# EAGLE schematic WMHS Team A Mission Possible Electrical (EAGLE 8.5.2)

## Sheet 1 of 16: Starting Action
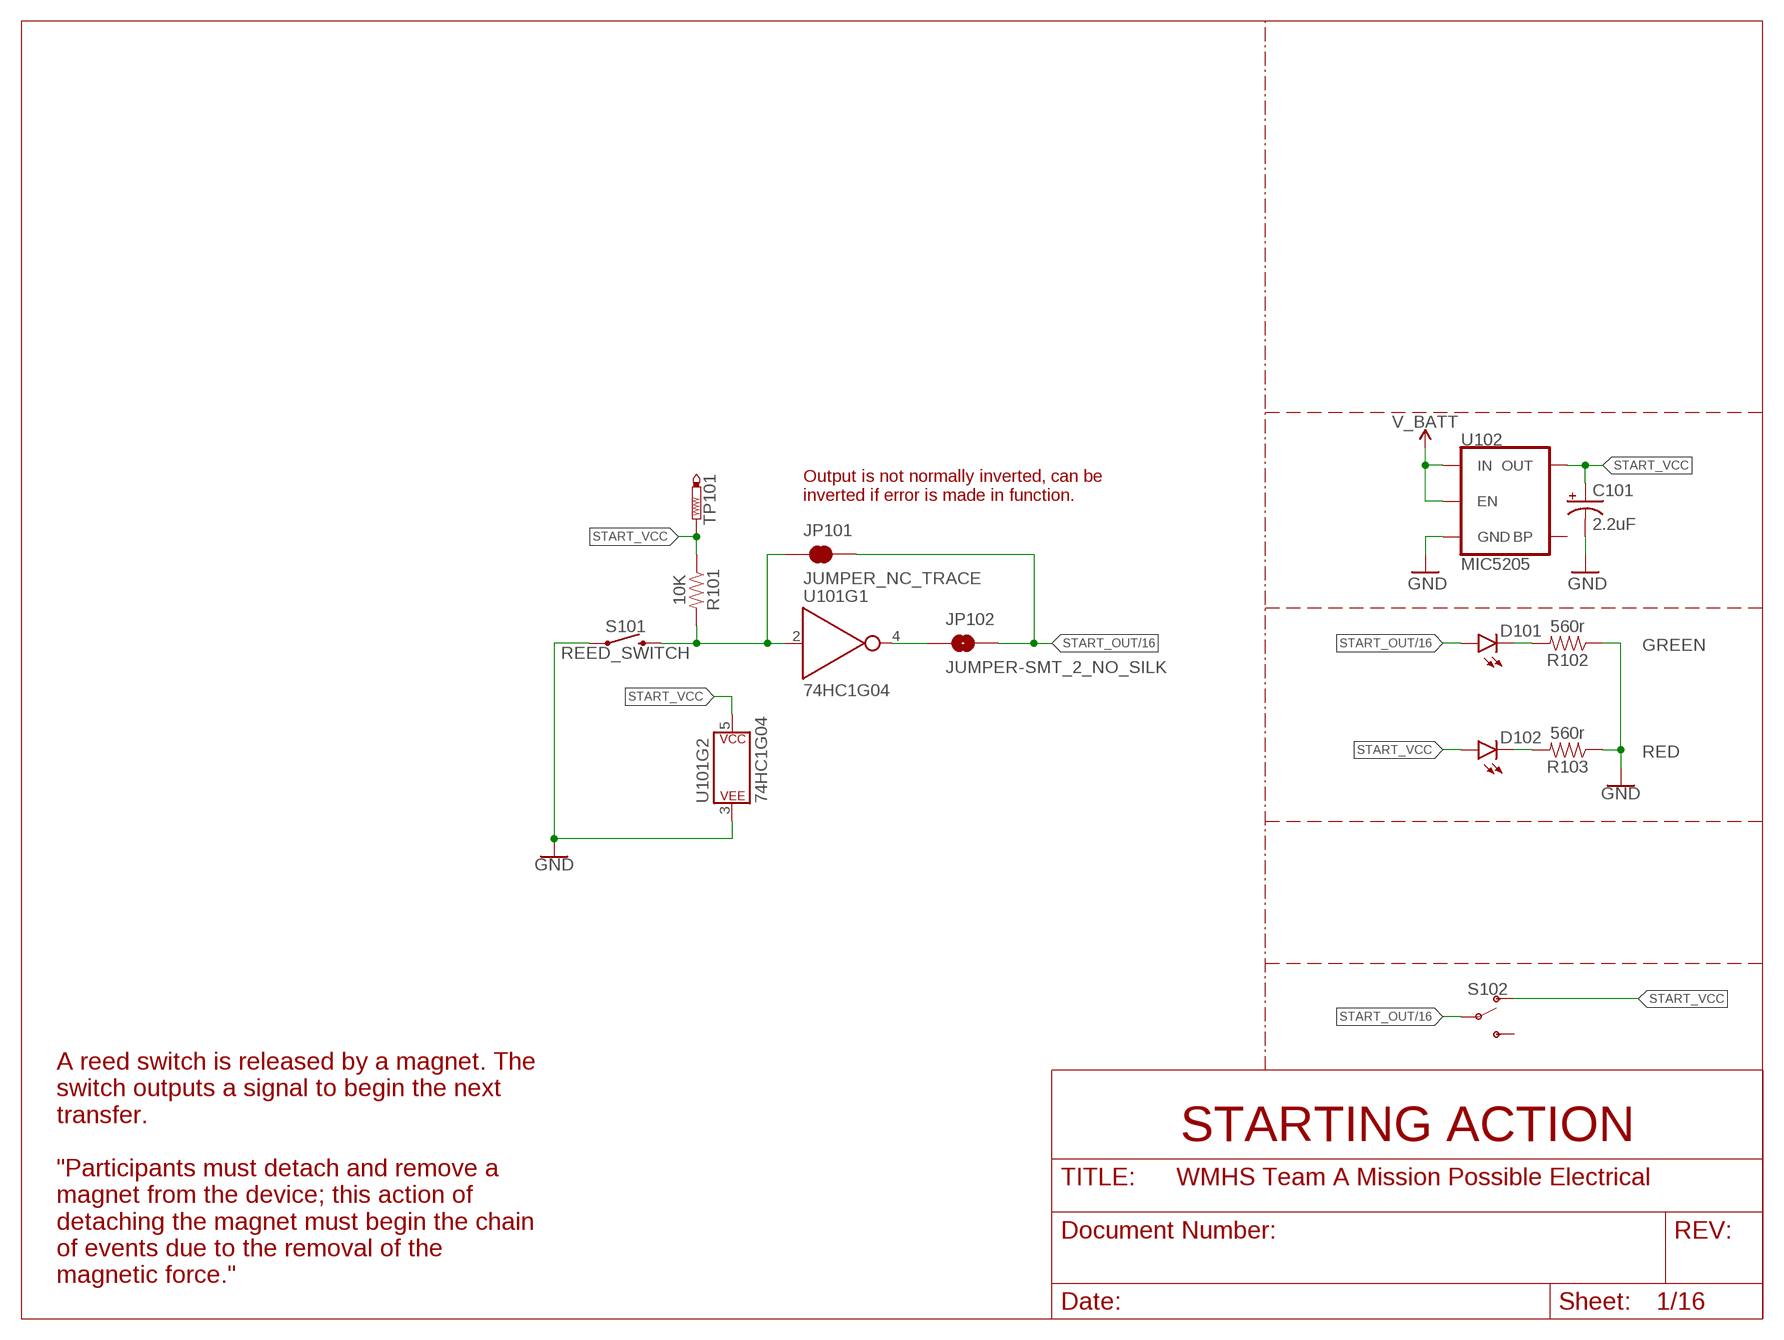
[diagram p0: schematic, sheet 1]

### Parts
C101  2.2uF  10UF-POLAR-EIA3216-16V-10%(TANT)  [EIA3216]
D101  GREEN  LED-GREEN0603  [LED-0603]
D102  RED  LED-RED0603  [LED-0603]
JP101  JUMPER_NC_TRACE  JUMPER-SMT_2_NC_TRACE_SILK  [SMT-JUMPER_2_NC_TRACE_SILK]
JP102  JUMPER-SMT_2_NO_SILK  [SMT-JUMPER_2_NO_SILK]
R101  10K  330OHM-0603-1/10W-1%  [0603]
R102  560r  330OHM-0603-1/10W-1%  [0603]
R103  560r  330OHM-0603-1/10W-1%  [0603]
S101  REED_SWITCH  MDSM-10_REED_SWITCH  [AXIAL_GULLWING_REED]
S102  SWITCH-SPDT-SMD-AYZ0202  [SWITCH_DPDT_SMD_AYZ0202]
TP101  PTR1TP20R  [TP20R]
U101  74HC1G04  [SOT353]
U102  MIC5205  V_REG_MIC52055V  [SOT23-5]

### Nets
GND: C101.- R102.1 R103.1 S101.P$1 U101.3(P$V-) U102.2(GND) ; also sheet 2,3,4,5,6,7,8,9,10,11,12,13,14,15,16
N$10: JP102.1 U101.4(Y)
N$16: JP101.1 R101.2 S101.P$2 U101.2(A)
N$132: D102.C R103.2
N$133: D101.C R102.2
START_OUT: D101.A JP101.2 JP102.2 S102.2(P) ; also sheet 16
START_VCC: C101.+ D102.A R101.1 S102.1(O) TP101.TP U101.5(P$V+) U102.5(OUT)
V_BATT: U102.1(IN) U102.3(EN) ; also sheet 2,3,4,5,6,7,8,9,10,11,12,13,14,15,16
Unconnected: S102.3(S) U102.4(BP)

### Notes on the sheet
- Output is not normally inverted, can be 
  inverted if error is made in function.
- A reed switch is released by a magnet. The 
  switch outputs a signal to begin the next 
  transfer.
- STARTING ACTION
- "Participants must detach and remove a
  magnet from the device; this action of 
  detaching the magnet must begin the chain 
  of events due to the removal of the 
  magnetic force."

## Sheet 2 of 16: Coin Flip
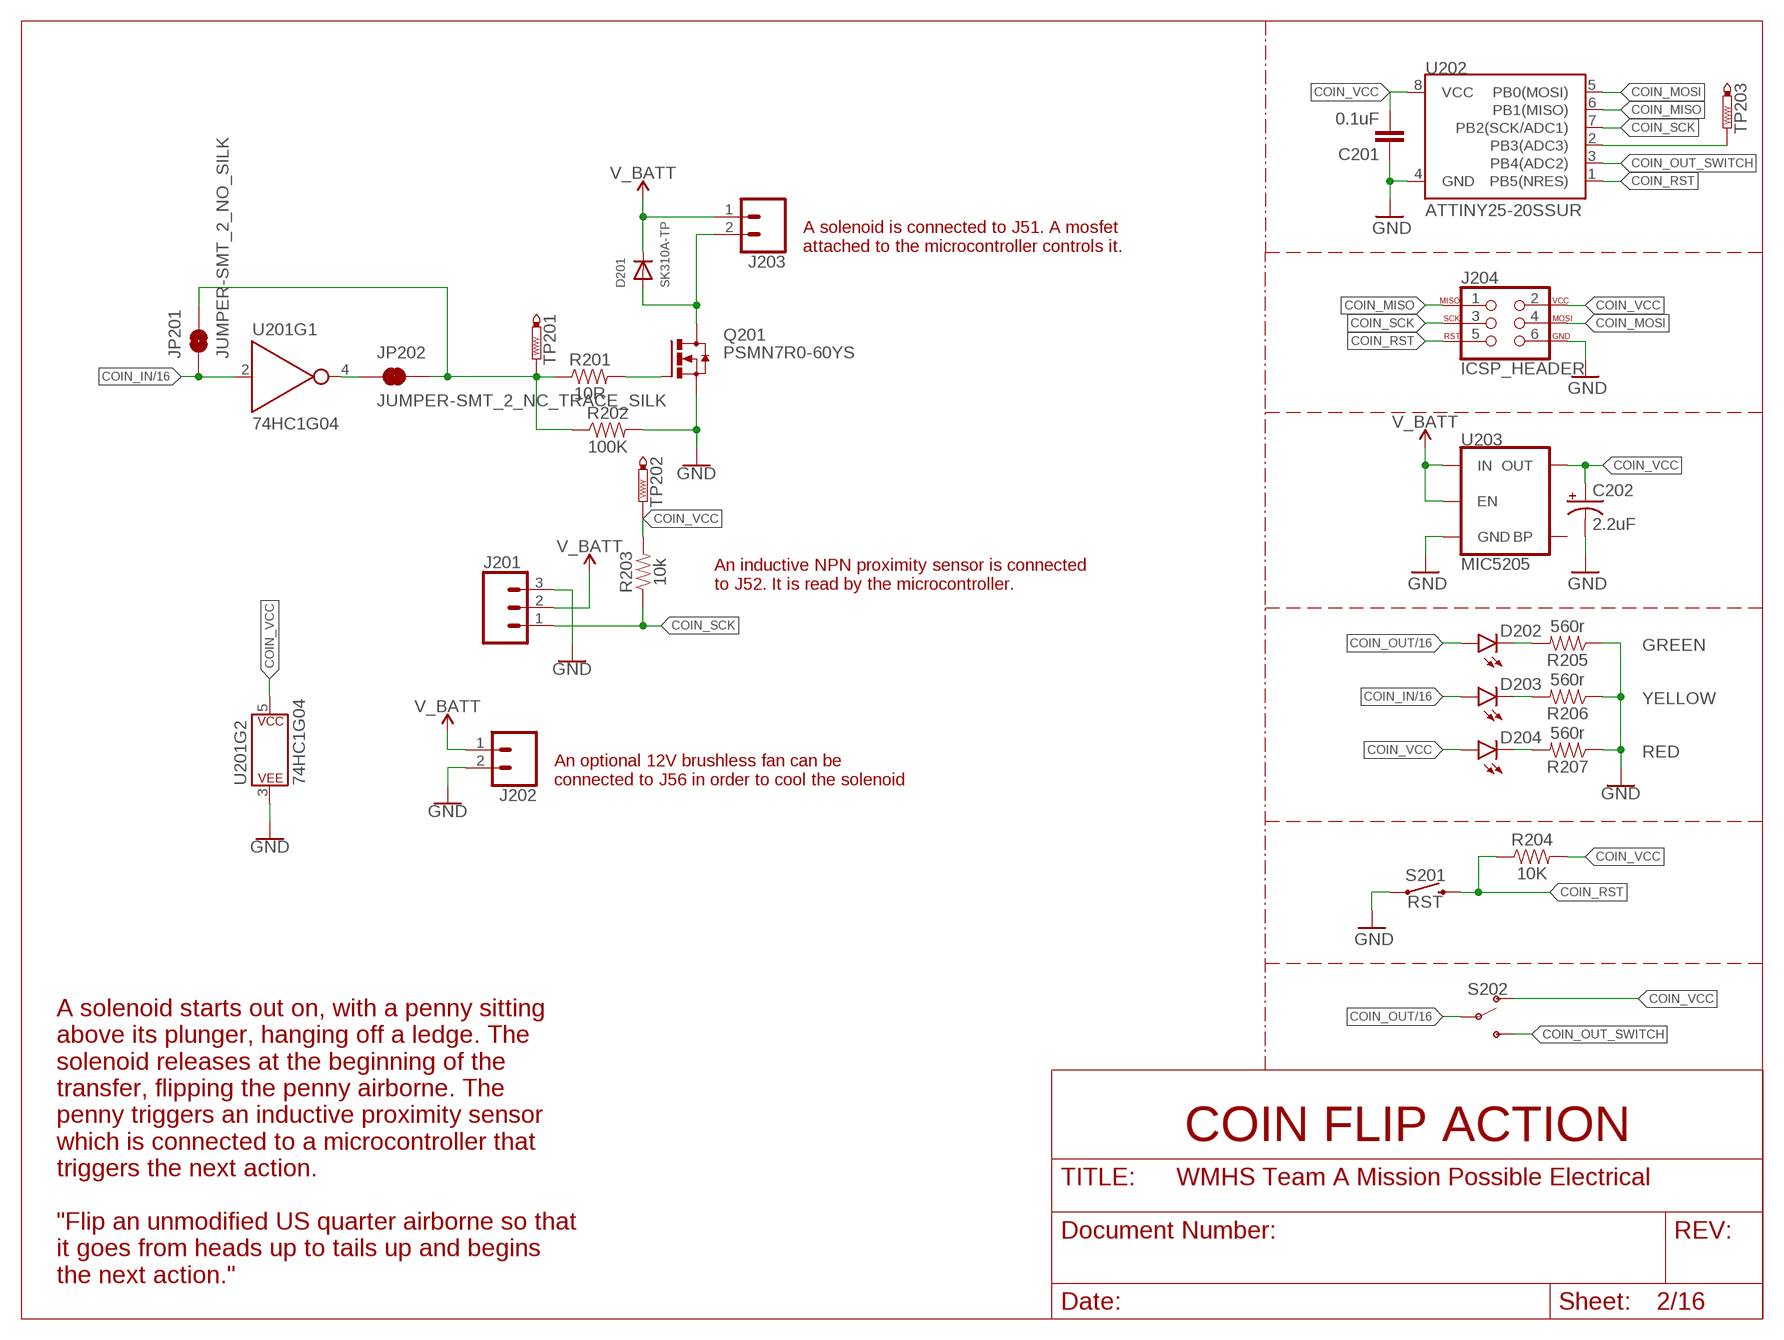
[diagram p1: schematic, sheet 2]

### Parts
C201  0.1uF  0.1UF-0603-25V-5%  [0603]
C202  2.2uF  10UF-POLAR-EIA3216-16V-10%(TANT)  [EIA3216]
D201  SK310A-TP  DIODESMA  [SMADIODE]
D202  GREEN  LED-GREEN0603  [LED-0603]
D203  YELLOW  LED-YELLOW0603  [LED-0603]
D204  RED  LED-RED0603  [LED-0603]
J201  CONN_03LOCK  [1X03_LOCK]
J202  CONN_02LOCK  [1X02_LOCK]
J203  CONN_023.5MM_LOCK  [SCREWTERMINAL-3.5MM-2_LOCK]
J204  ICSP_HEADER  AVR_SPI_PROG_3X2PTH  [2X3]
JP201  JUMPER-SMT_2_NO_SILK  [SMT-JUMPER_2_NO_SILK]
JP202  JUMPER-SMT_2_NC_TRACE_SILK  [SMT-JUMPER_2_NC_TRACE_SILK]
Q201  PSMN7R0-60YS  [SOT669]
R201  10R  RESISTOR0603  [0603]
R202  100K  RESISTOR0603  [0603]
R203  10k  RESISTOR0603  [0603]
R204  10K  330OHM-0603-1/10W-1%  [0603]
R205  560r  330OHM-0603-1/10W-1%  [0603]
R206  560r  330OHM-0603-1/10W-1%  [0603]
R207  560r  330OHM-0603-1/10W-1%  [0603]
S201  RST  MOMENTARY-SWITCH-SPST-SMD-5.2-REDUNDANT  [TACTILE_SWITCH_SMD_5.2MM]
S202  SWITCH-SPDT-SMD-AYZ0202  [SWITCH_DPDT_SMD_AYZ0202]
TP201  PTR1TP20R  [TP20R]
TP202  PTR1TP20R  [TP20R]
TP203  PTR1TP20R  [TP20R]
U201  74HC1G04  [SOT353]
U202  ATTINY25-20SSUR  ATTINY45-SMT-NARROW  [SOIC8]
U203  MIC5205  V_REG_MIC52055V  [SOT23-5]

### Nets
COIN_IN: D203.A JP201.1 U201.2(A) ; also sheet 16
COIN_MISO: J204.1 U202.6(PB1(MISO))
COIN_MOSI: J204.4 U202.5(PB0(MOSI))
COIN_OUT: D202.A S202.2(P) ; also sheet 16
COIN_OUT_SWITCH: S202.3(S) U202.3(PB4(ADC2))
COIN_RST: J204.5 R204.1 S201.3 S201.4 U202.1(PB5(NRES))
COIN_SCK: J201.1 J204.3 R203.1 U202.7(PB2(SCK/ADC1))
COIN_VCC: C201.2 C202.+ D204.A J204.2 R203.2 R204.2 S202.1(O) TP202.TP U201.5(P$V+) U202.8(VCC) U203.5(OUT)
GND: C201.1 C202.- J201.3 J202.2 J204.6 Q201.1(S) Q201.2(S) Q201.3(S) R202.2 R205.1 R206.1 R207.1 S201.1 S201.2 U201.3(P$V-) U202.4(GND) U203.2(GND) ; also sheet 1,3,4,5,6,7,8,9,10,11,12,13,14,15,16
N$17: TP203.TP U202.2(PB3(ADC3))
N$19: JP201.2 JP202.2 R201.1 R202.1 TP201.TP
N$20: JP202.1 U201.4(Y)
N$101: Q201.4(G) R201.2
N$102: D201.A J203.2 Q201.MB(D)
N$134: D204.C R207.2
N$135: D203.C R206.2
N$136: D202.C R205.2
V_BATT: D201.C J201.2 J202.1 J203.1 U203.1(IN) U203.3(EN) ; also sheet 1,3,4,5,6,7,8,9,10,11,12,13,14,15,16
Unconnected: U203.4(BP)

### Notes on the sheet
- A solenoid is connected to J51. A mosfet 
  attached to the microcontroller controls it.
- An inductive NPN proximity sensor is connected 
  to J52. It is read by the microcontroller.
- An optional 12V brushless fan can be 
  connected to J56 in order to cool the solenoid
- COIN FLIP ACTION
- A solenoid starts out on, with a penny sitting 
  above its plunger, hanging off a ledge. The 
  solenoid releases at the beginning of the 
  transfer, flipping the penny airborne. The 
  penny triggers an inductive proximity sensor 
  which is connected to a microcontroller that 
  triggers the next action.
- "Flip an unmodified US quarter airborne so that 
  it goes from heads up to tails up and begins 
  the next action."

## Sheet 3 of 16: Exothermic
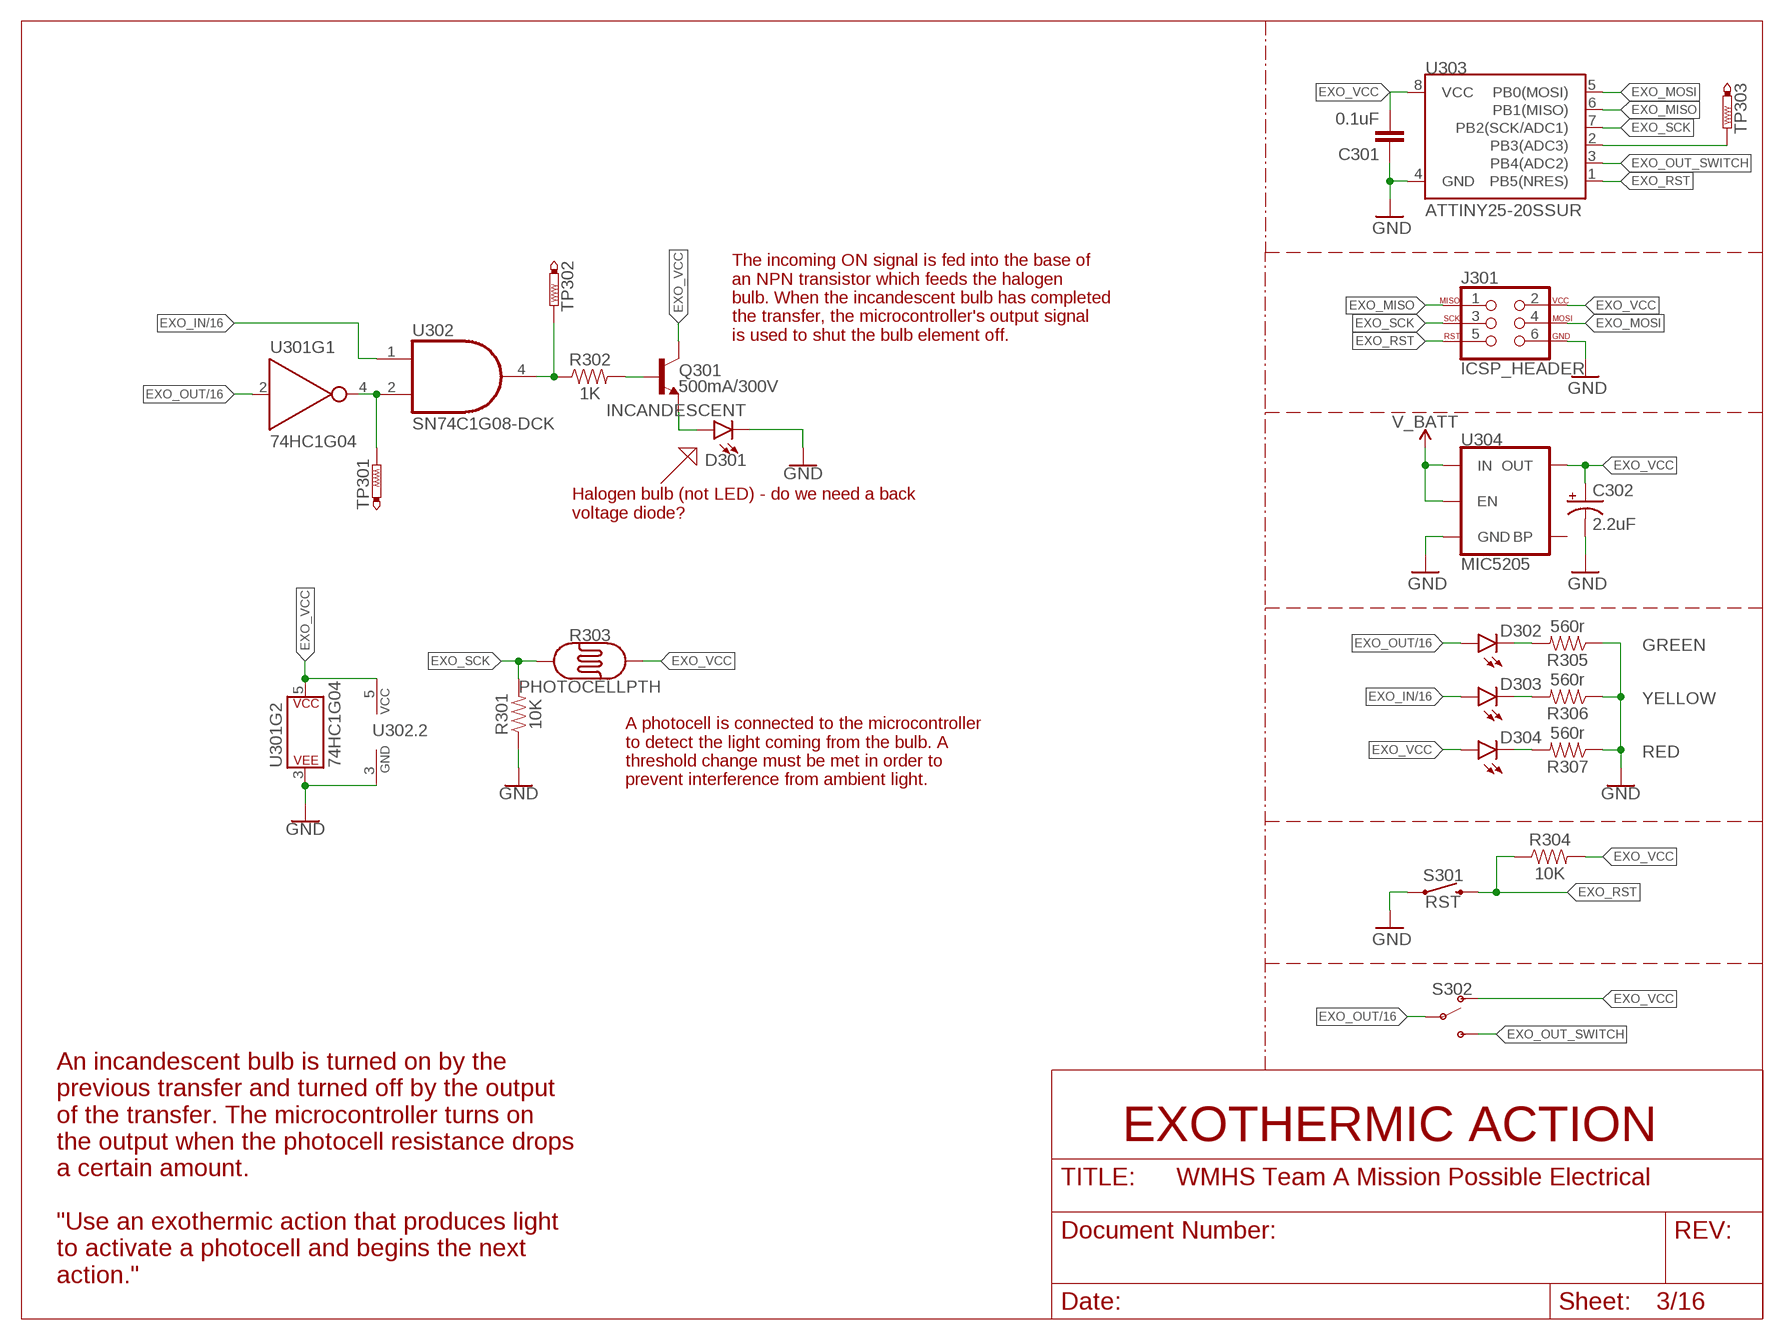
[diagram p2: schematic, sheet 3]

### Parts
C301  0.1uF  0.1UF-0603-25V-5%  [0603]
C302  2.2uF  10UF-POLAR-EIA3216-16V-10%(TANT)  [EIA3216]
D301  INCANDESCENT  LED3MM  [LED_3MM]
D302  GREEN  LED-GREEN0603  [LED-0603]
D303  YELLOW  LED-YELLOW0603  [LED-0603]
D304  RED  LED-RED0603  [LED-0603]
J301  ICSP_HEADER  AVR_SPI_PROG_3X2PTH  [2X3]
Q301  500mA/300V  TRANS_NPN-MMBTA42  [SOT23-3]
R301  10K  RESISTOR0603  [0603]
R302  1K  RESISTOR0603  [0603]
R303  PHOTOCELLPTH  [PHOTOCELL]
R304  10K  330OHM-0603-1/10W-1%  [0603]
R305  560r  330OHM-0603-1/10W-1%  [0603]
R306  560r  330OHM-0603-1/10W-1%  [0603]
R307  560r  330OHM-0603-1/10W-1%  [0603]
S301  RST  MOMENTARY-SWITCH-SPST-SMD-5.2-REDUNDANT  [TACTILE_SWITCH_SMD_5.2MM]
S302  SWITCH-SPDT-SMD-AYZ0202  [SWITCH_DPDT_SMD_AYZ0202]
TP301  PTR1TP20R  [TP20R]
TP302  PTR1TP20R  [TP20R]
TP303  PTR1TP20R  [TP20R]
U301  74HC1G04  [SOT353]
U302  SN74C1G08-DCK  [SC-70-5]
U303  ATTINY25-20SSUR  ATTINY45-SMT-NARROW  [SOIC8]
U304  MIC5205  V_REG_MIC52055V  [SOT23-5]

### Nets
EXO_IN: D303.A U302.1(A) ; also sheet 16
EXO_MISO: J301.1 U303.6(PB1(MISO))
EXO_MOSI: J301.4 U303.5(PB0(MOSI))
EXO_OUT: D302.A S302.2(P) U301.2(A) ; also sheet 16
EXO_OUT_SWITCH: S302.3(S) U303.3(PB4(ADC2))
EXO_RST: J301.5 R304.1 S301.3 S301.4 U303.1(PB5(NRES))
EXO_SCK: J301.3 R301.2 R303.1 U303.7(PB2(SCK/ADC1))
EXO_VCC: C301.2 C302.+ D304.A J301.2 Q301.3(C) R303.2 R304.2 S302.1(O) U301.5(P$V+) U302.5(VCC) U303.8(VCC) U304.5(OUT)
GND: C301.1 C302.- D301.K(C) J301.6 R301.1 R305.1 R306.1 R307.1 S301.1 S301.2 U301.3(P$V-) U302.3(GND) U303.4(GND) U304.2(GND) ; also sheet 1,2,4,5,6,7,8,9,10,11,12,13,14,15,16
N$3: R302.1 TP302.TP U302.4(Y)
N$4: TP301.TP U301.4(Y) U302.2(B)
N$22: TP303.TP U303.2(PB3(ADC3))
N$97: Q301.1(B) R302.2
N$98: D301.A Q301.2(E)
N$137: D304.C R307.2
N$138: D303.C R306.2
N$139: D302.C R305.2
V_BATT: U304.1(IN) U304.3(EN) ; also sheet 1,2,4,5,6,7,8,9,10,11,12,13,14,15,16
Unconnected: U304.4(BP)

### Notes on the sheet
- The incoming ON signal is fed into the base of 
  an NPN transistor which feeds the halogen 
  bulb. When the incandescent bulb has completed 
  the transfer, the microcontroller's output signal 
  is used to shut the bulb element off.
- Halogen bulb (not LED) - do we need a back 
  voltage diode?
- A photocell is connected to the microcontroller 
  to detect the light coming from the bulb. A 
  threshold change must be met in order to 
  prevent interference from ambient light.
- EXOTHERMIC ACTION
- An incandescent bulb is turned on by the 
  previous transfer and turned off by the output 
  of the transfer. The microcontroller turns on 
  the output when the photocell resistance drops 
  a certain amount.
- "Use an exothermic action that produces light 
  to activate a photocell and begins the next 
  action."

## Sheet 4 of 16: Light Triggered
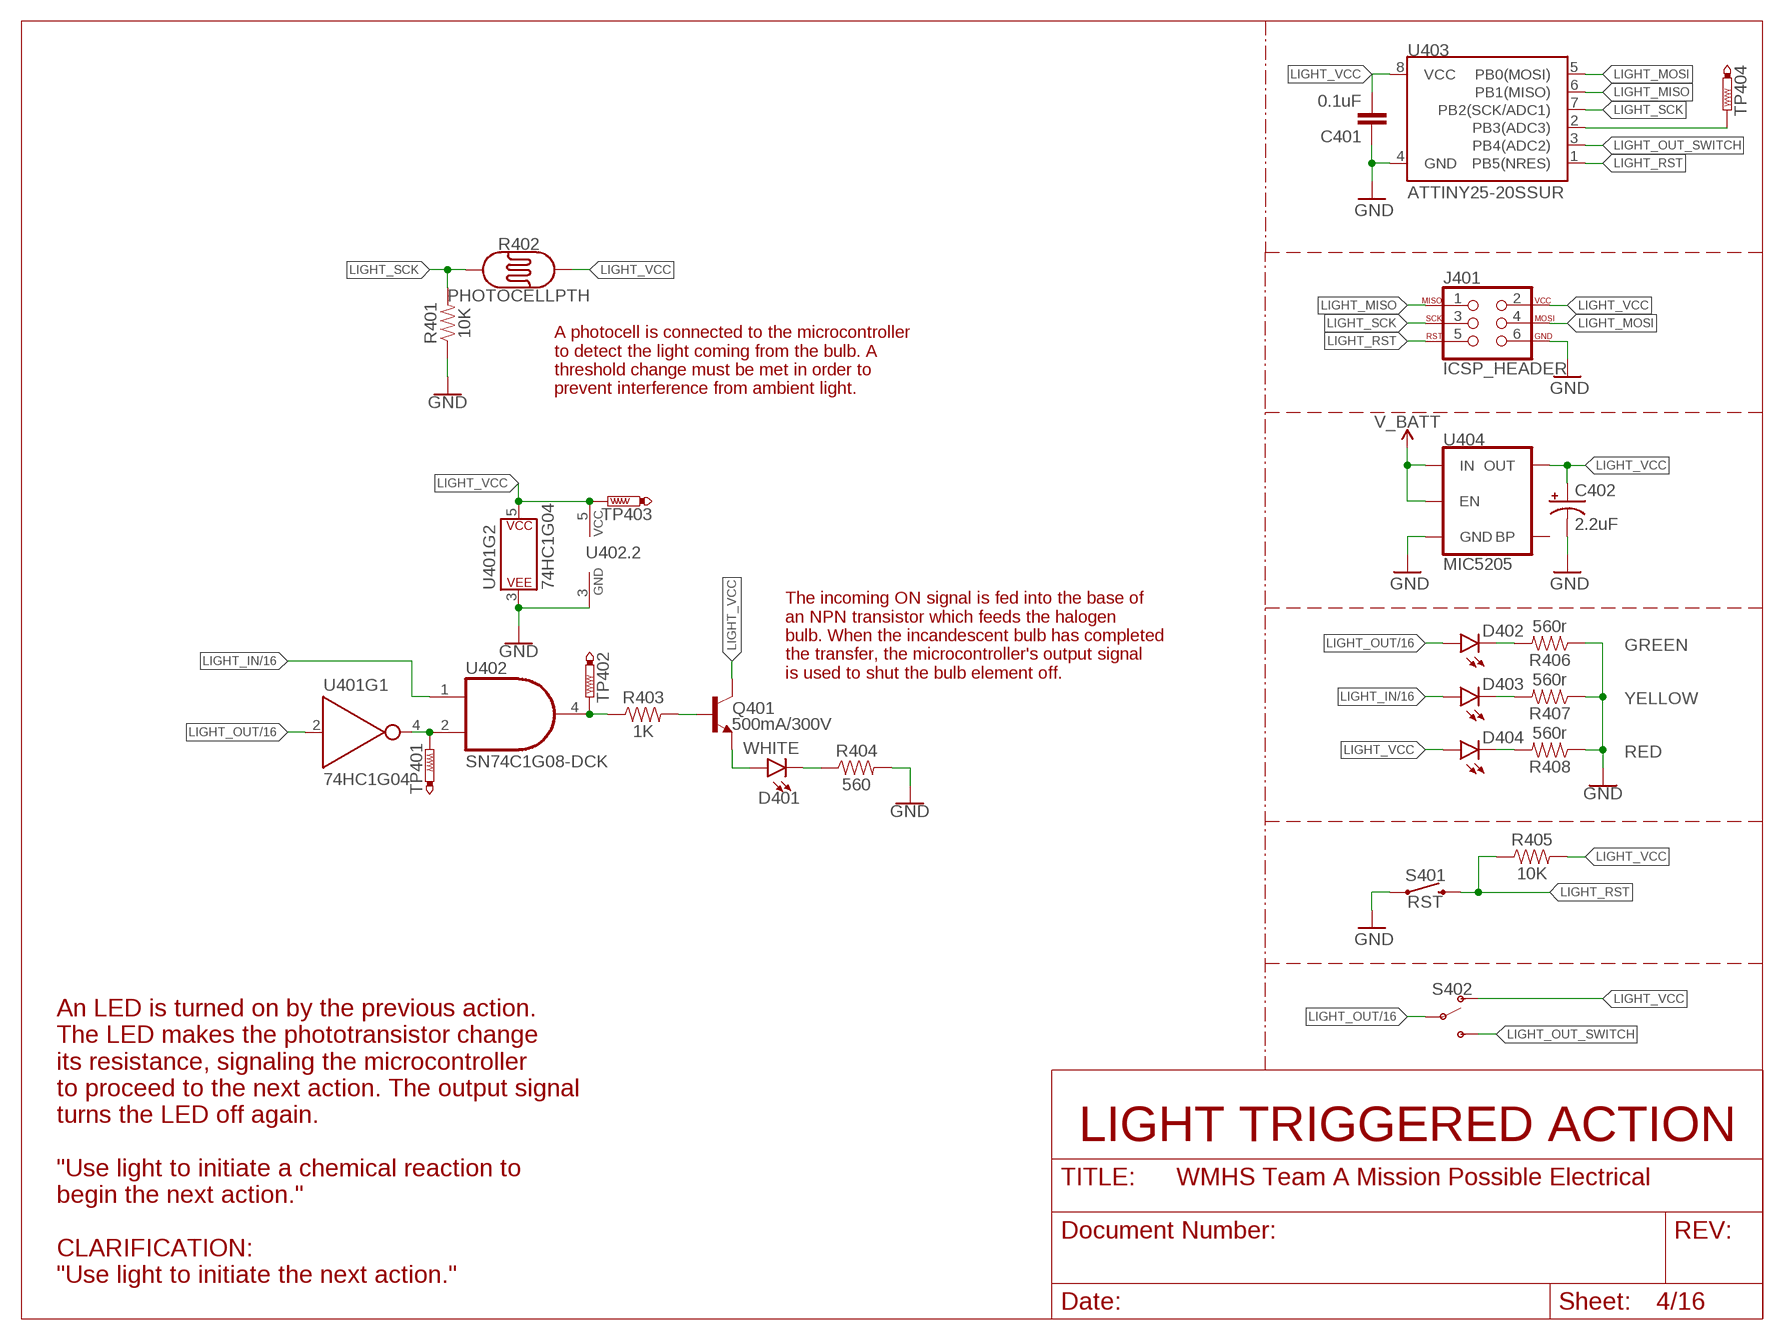
[diagram p3: schematic, sheet 4]

### Parts
C401  0.1uF  0.1UF-0603-25V-5%  [0603]
C402  2.2uF  10UF-POLAR-EIA3216-16V-10%(TANT)  [EIA3216]
D401  WHITE  LED3MM  [LED_3MM]
D402  GREEN  LED-GREEN0603  [LED-0603]
D403  YELLOW  LED-YELLOW0603  [LED-0603]
D404  RED  LED-RED0603  [LED-0603]
J401  ICSP_HEADER  AVR_SPI_PROG_3X2PTH  [2X3]
Q401  500mA/300V  TRANS_NPN-MMBTA42  [SOT23-3]
R401  10K  RESISTOR0603  [0603]
R402  PHOTOCELLPTH  [PHOTOCELL]
R403  1K  RESISTOR0603  [0603]
R404  560  RESISTOR0603  [0603]
R405  10K  330OHM-0603-1/10W-1%  [0603]
R406  560r  330OHM-0603-1/10W-1%  [0603]
R407  560r  330OHM-0603-1/10W-1%  [0603]
R408  560r  330OHM-0603-1/10W-1%  [0603]
S401  RST  MOMENTARY-SWITCH-SPST-SMD-5.2-REDUNDANT  [TACTILE_SWITCH_SMD_5.2MM]
S402  SWITCH-SPDT-SMD-AYZ0202  [SWITCH_DPDT_SMD_AYZ0202]
TP401  PTR1TP20R  [TP20R]
TP402  PTR1TP20R  [TP20R]
TP403  PTR1TP20R  [TP20R]
TP404  PTR1TP20R  [TP20R]
U401  74HC1G04  [SOT353]
U402  SN74C1G08-DCK  [SC-70-5]
U403  ATTINY25-20SSUR  ATTINY45-SMT-NARROW  [SOIC8]
U404  MIC5205  V_REG_MIC52055V  [SOT23-5]

### Nets
GND: C401.1 C402.- J401.6 R401.1 R404.2 R406.1 R407.1 R408.1 S401.1 S401.2 U401.3(P$V-) U402.3(GND) U403.4(GND) U404.2(GND) ; also sheet 1,2,3,5,6,7,8,9,10,11,12,13,14,15,16
LIGHT_IN: D403.A U402.1(A) ; also sheet 16
LIGHT_MISO: J401.1 U403.6(PB1(MISO))
LIGHT_MOSI: J401.4 U403.5(PB0(MOSI))
LIGHT_OUT: D402.A S402.2(P) U401.2(A) ; also sheet 16
LIGHT_OUT_SWITCH: S402.3(S) U403.3(PB4(ADC2))
LIGHT_RST: J401.5 R405.1 S401.3 S401.4 U403.1(PB5(NRES))
LIGHT_SCK: J401.3 R401.2 R402.1 U403.7(PB2(SCK/ADC1))
LIGHT_VCC: C401.2 C402.+ D404.A J401.2 Q401.3(C) R402.2 R405.2 S402.1(O) TP403.TP U401.5(P$V+) U402.5(VCC) U403.8(VCC) U404.5(OUT)
N$6: Q401.1(B) R403.2
N$7: D401.A Q401.2(E)
N$8: R403.1 TP402.TP U402.4(Y)
N$9: TP401.TP U401.4(Y) U402.2(B)
N$23: TP404.TP U403.2(PB3(ADC3))
N$48: D401.K(C) R404.1
N$140: D404.C R408.2
N$141: D403.C R407.2
N$142: D402.C R406.2
V_BATT: U404.1(IN) U404.3(EN) ; also sheet 1,2,3,5,6,7,8,9,10,11,12,13,14,15,16
Unconnected: U404.4(BP)

### Notes on the sheet
- A photocell is connected to the microcontroller 
  to detect the light coming from the bulb. A 
  threshold change must be met in order to 
  prevent interference from ambient light.
- The incoming ON signal is fed into the base of 
  an NPN transistor which feeds the halogen 
  bulb. When the incandescent bulb has completed 
  the transfer, the microcontroller's output signal 
  is used to shut the bulb element off.
- An LED is turned on by the previous action. 
  The LED makes the phototransistor change 
  its resistance, signaling the microcontroller 
  to proceed to the next action. The output signal 
  turns the LED off again.
- LIGHT TRIGGERED ACTION
- "Use light to initiate a chemical reaction to 
  begin the next action."
  
  CLARIFICATION:
  "Use light to initiate the next action."

## Sheet 5 of 16: Endothermic
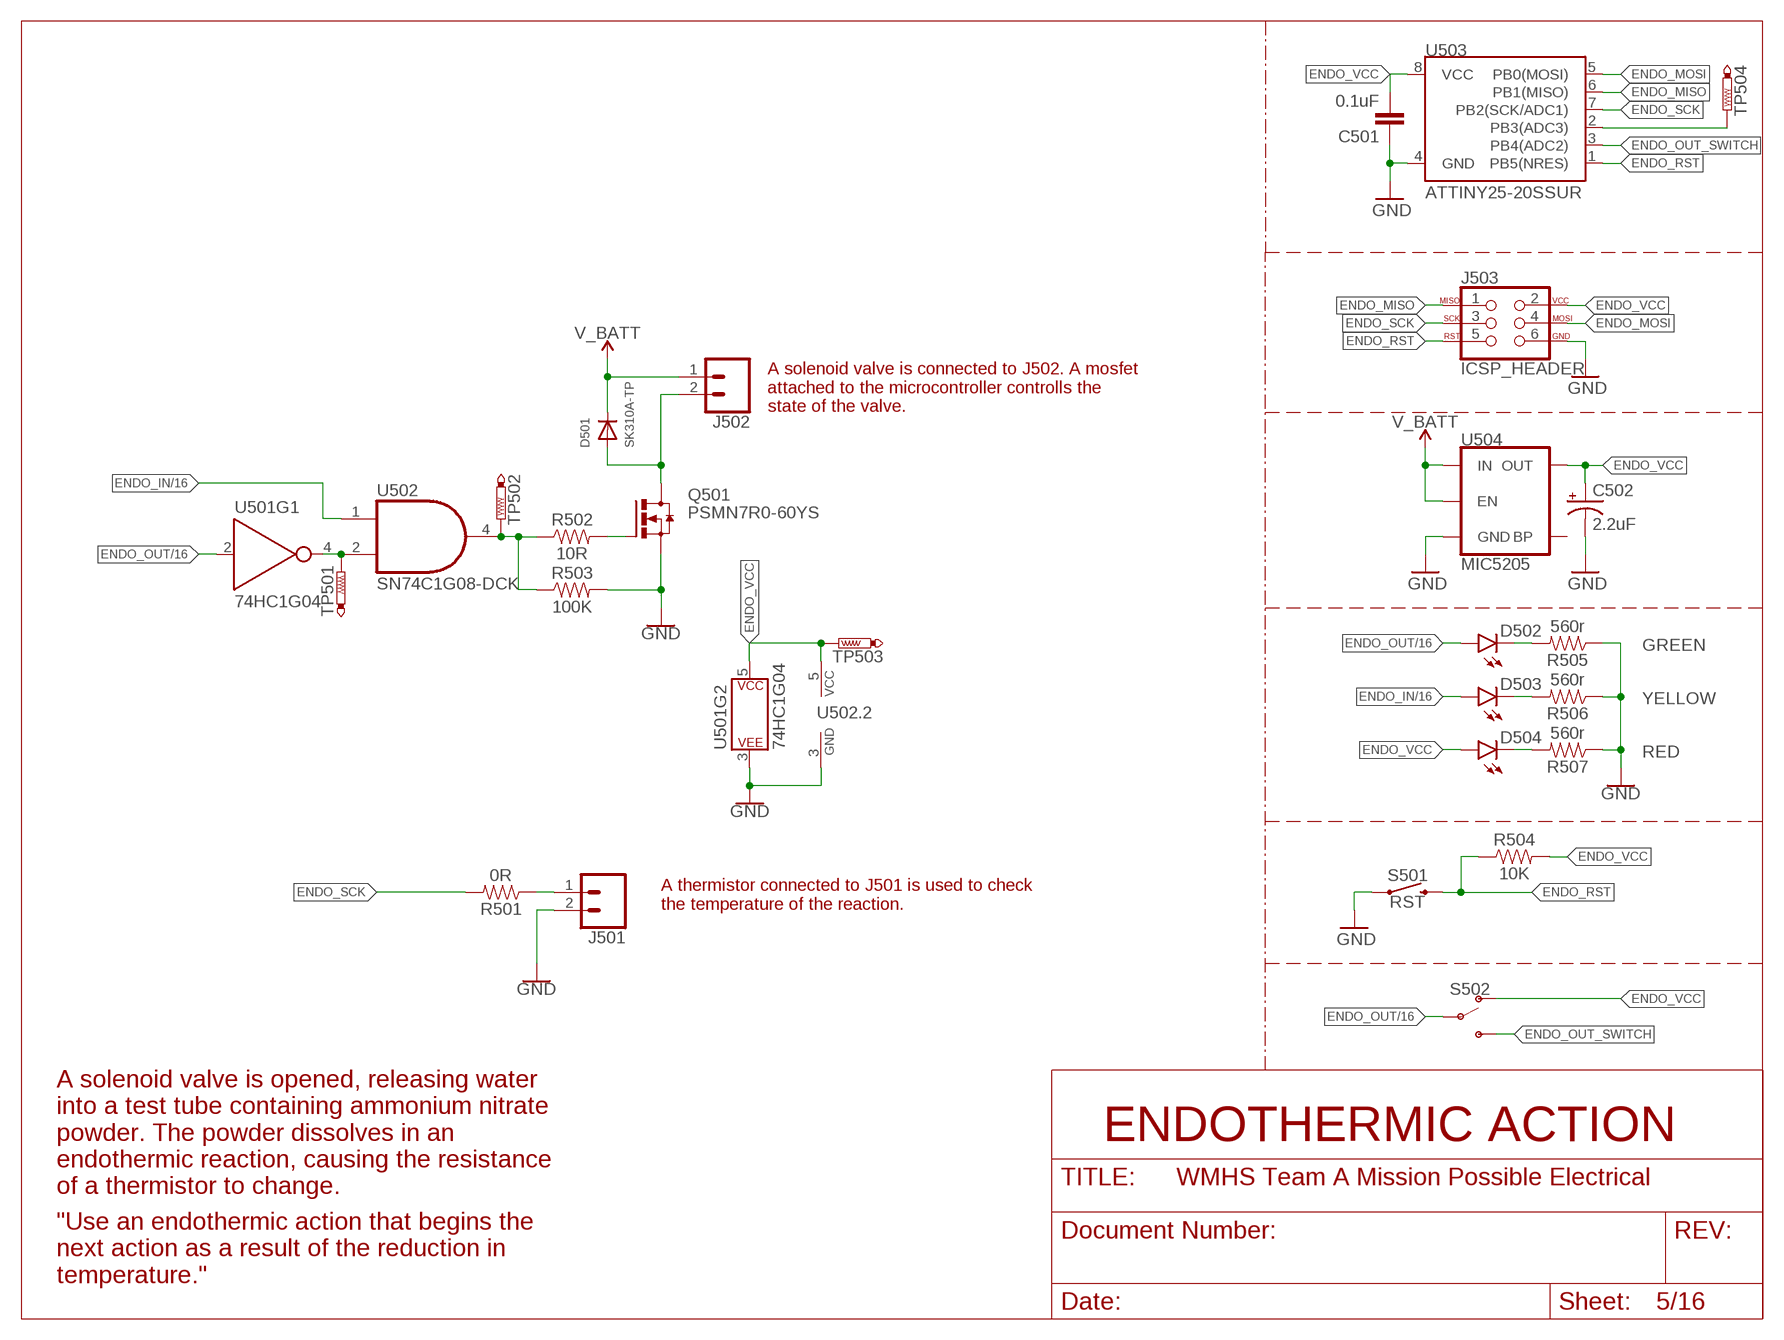
[diagram p4: schematic, sheet 5]

### Parts
C501  0.1uF  0.1UF-0603-25V-5%  [0603]
C502  2.2uF  10UF-POLAR-EIA3216-16V-10%(TANT)  [EIA3216]
D501  SK310A-TP  DIODESMA  [SMADIODE]
D502  GREEN  LED-GREEN0603  [LED-0603]
D503  YELLOW  LED-YELLOW0603  [LED-0603]
D504  RED  LED-RED0603  [LED-0603]
J501  CONN_02LOCK  [1X02_LOCK]
J502  CONN_023.5MM_LOCK  [SCREWTERMINAL-3.5MM-2_LOCK]
J503  ICSP_HEADER  AVR_SPI_PROG_3X2PTH  [2X3]
Q501  PSMN7R0-60YS  [SOT669]
R501  0R  RESISTOR0603  [0603]
R502  10R  RESISTOR0603  [0603]
R503  100K  RESISTOR0603  [0603]
R504  10K  330OHM-0603-1/10W-1%  [0603]
R505  560r  330OHM-0603-1/10W-1%  [0603]
R506  560r  330OHM-0603-1/10W-1%  [0603]
R507  560r  330OHM-0603-1/10W-1%  [0603]
S501  RST  MOMENTARY-SWITCH-SPST-SMD-5.2-REDUNDANT  [TACTILE_SWITCH_SMD_5.2MM]
S502  SWITCH-SPDT-SMD-AYZ0202  [SWITCH_DPDT_SMD_AYZ0202]
TP501  PTR1TP20R  [TP20R]
TP502  PTR1TP20R  [TP20R]
TP503  PTR1TP20R  [TP20R]
TP504  PTR1TP20R  [TP20R]
U501  74HC1G04  [SOT353]
U502  SN74C1G08-DCK  [SC-70-5]
U503  ATTINY25-20SSUR  ATTINY45-SMT-NARROW  [SOIC8]
U504  MIC5205  V_REG_MIC52055V  [SOT23-5]

### Nets
ENDO_IN: D503.A U502.1(A) ; also sheet 16
ENDO_MISO: J503.1 U503.6(PB1(MISO))
ENDO_MOSI: J503.4 U503.5(PB0(MOSI))
ENDO_OUT: D502.A S502.2(P) U501.2(A) ; also sheet 16
ENDO_OUT_SWITCH: S502.3(S) U503.3(PB4(ADC2))
ENDO_RST: J503.5 R504.1 S501.3 S501.4 U503.1(PB5(NRES))
ENDO_SCK: J503.3 R501.2 U503.7(PB2(SCK/ADC1))
ENDO_VCC: C501.2 C502.+ D504.A J503.2 R504.2 S502.1(O) TP503.TP U501.5(P$V+) U502.5(VCC) U503.8(VCC) U504.5(OUT)
GND: C501.1 C502.- J501.2 J503.6 Q501.1(S) Q501.2(S) Q501.3(S) R503.2 R505.1 R506.1 R507.1 S501.1 S501.2 U501.3(P$V-) U502.3(GND) U503.4(GND) U504.2(GND) ; also sheet 1,2,3,4,6,7,8,9,10,11,12,13,14,15,16
N$1: TP501.TP U501.4(Y) U502.2(B)
N$24: TP504.TP U503.2(PB3(ADC3))
N$52: J501.1 R501.1
N$54: Q501.4(G) R502.2
N$56: D501.A J502.2 Q501.MB(D)
N$64: R502.1 R503.1 TP502.TP U502.4(Y)
N$143: D504.C R507.2
N$144: D503.C R506.2
N$145: D502.C R505.2
V_BATT: D501.C J502.1 U504.1(IN) U504.3(EN) ; also sheet 1,2,3,4,6,7,8,9,10,11,12,13,14,15,16
Unconnected: U504.4(BP)

### Notes on the sheet
- A solenoid valve is connected to J502. A mosfet 
  attached to the microcontroller controlls the 
  state of the valve.
- A thermistor connected to J501 is used to check 
  the temperature of the reaction.
- ENDOTHERMIC ACTION
- A solenoid valve is opened, releasing water 
  into a test tube containing ammonium nitrate 
  powder. The powder dissolves in an 
  endothermic reaction, causing the resistance 
  of a thermistor to change.
- "Use an endothermic action that begins the 
  next action as a result of the reduction in 
  temperature."

## Sheet 6 of 16: Water
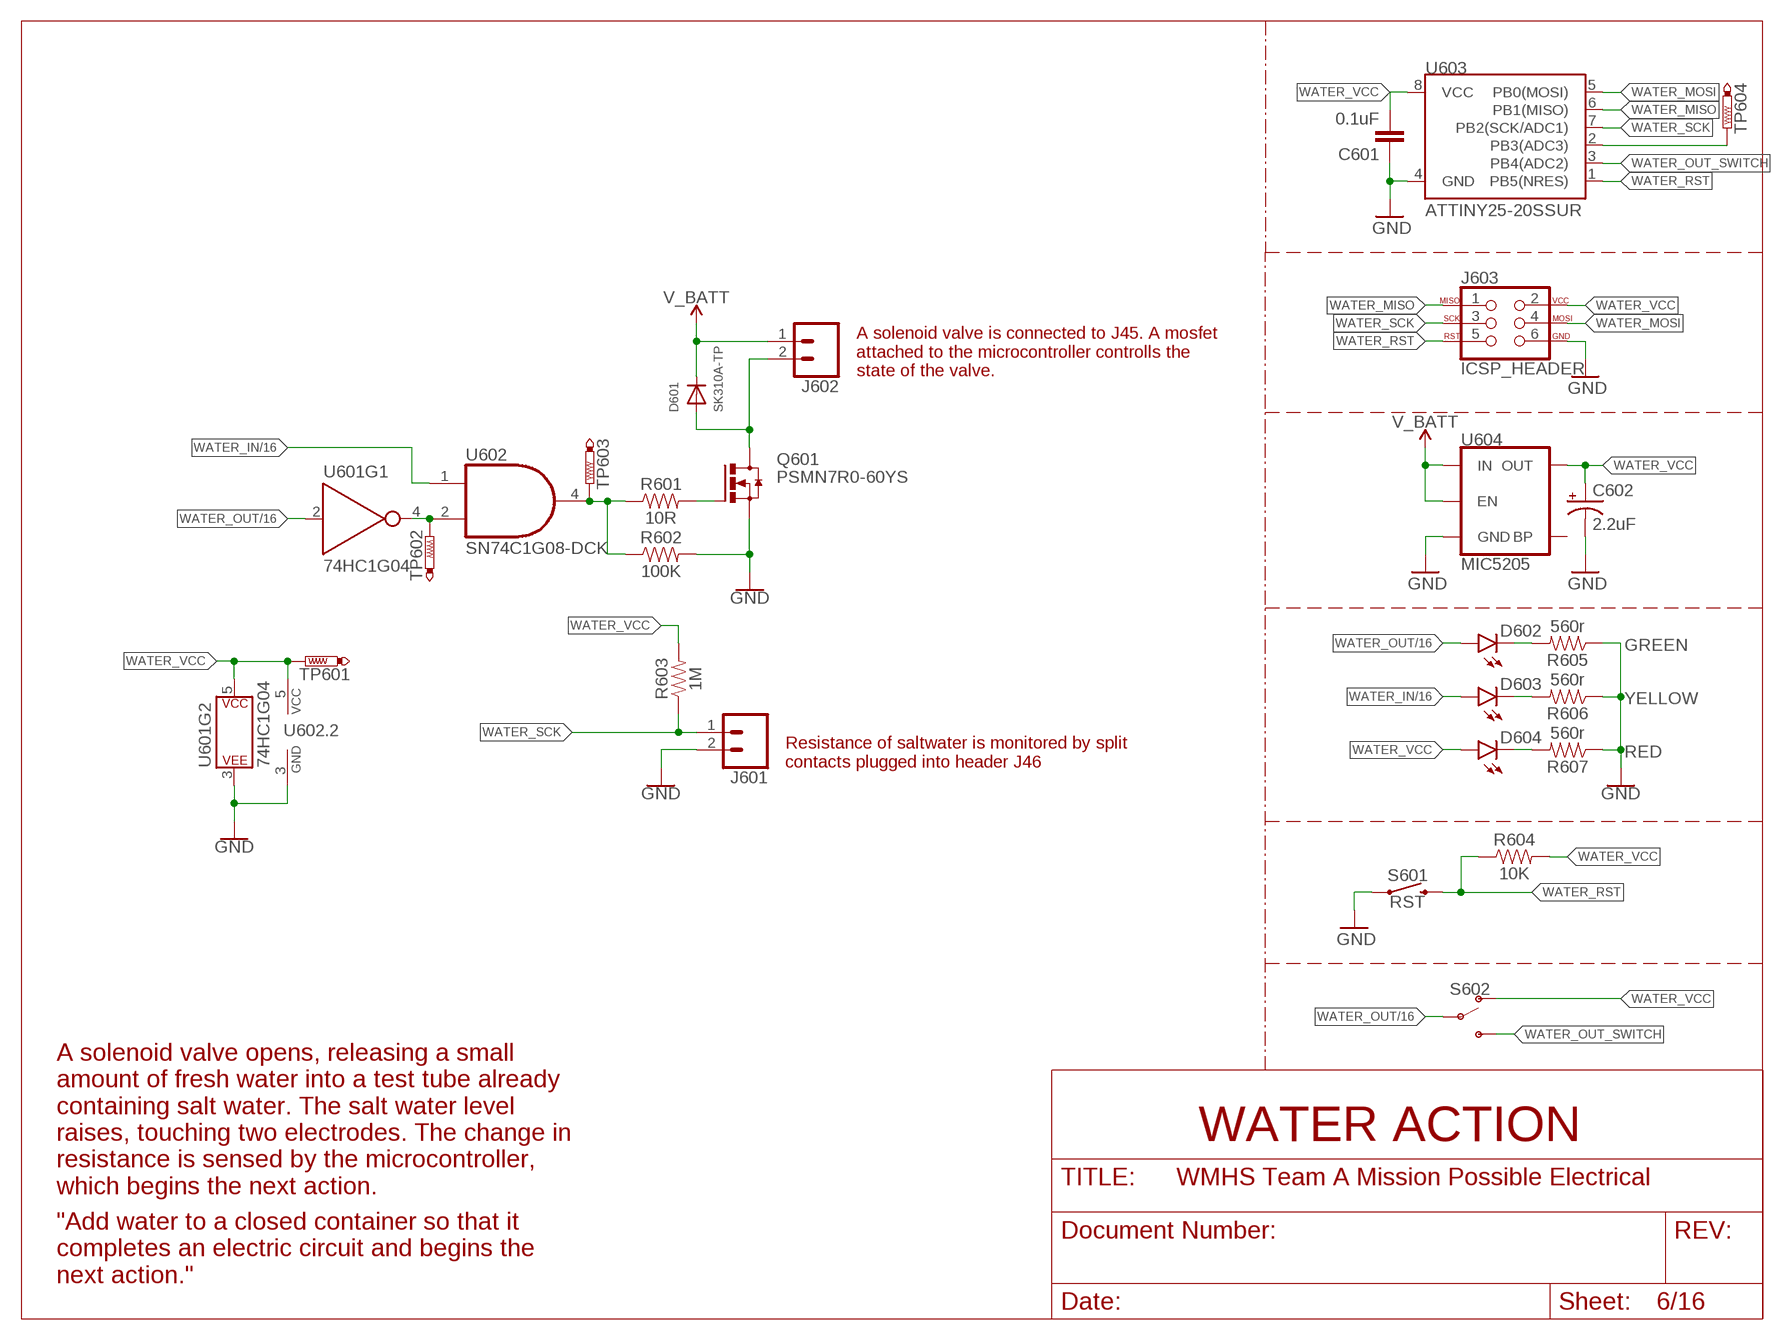
[diagram p5: schematic, sheet 6]

### Parts
C601  0.1uF  0.1UF-0603-25V-5%  [0603]
C602  2.2uF  10UF-POLAR-EIA3216-16V-10%(TANT)  [EIA3216]
D601  SK310A-TP  DIODESMA  [SMADIODE]
D602  GREEN  LED-GREEN0603  [LED-0603]
D603  YELLOW  LED-YELLOW0603  [LED-0603]
D604  RED  LED-RED0603  [LED-0603]
J601  CONN_02LOCK  [1X02_LOCK]
J602  CONN_023.5MM_LOCK  [SCREWTERMINAL-3.5MM-2_LOCK]
J603  ICSP_HEADER  AVR_SPI_PROG_3X2PTH  [2X3]
Q601  PSMN7R0-60YS  [SOT669]
R601  10R  RESISTOR0603  [0603]
R602  100K  RESISTOR0603  [0603]
R603  1M  RESISTOR0603  [0603]
R604  10K  330OHM-0603-1/10W-1%  [0603]
R605  560r  330OHM-0603-1/10W-1%  [0603]
R606  560r  330OHM-0603-1/10W-1%  [0603]
R607  560r  330OHM-0603-1/10W-1%  [0603]
S601  RST  MOMENTARY-SWITCH-SPST-SMD-5.2-REDUNDANT  [TACTILE_SWITCH_SMD_5.2MM]
S602  SWITCH-SPDT-SMD-AYZ0202  [SWITCH_DPDT_SMD_AYZ0202]
TP601  PTR1TP20R  [TP20R]
TP602  PTR1TP20R  [TP20R]
TP603  PTR1TP20R  [TP20R]
TP604  PTR1TP20R  [TP20R]
U601  74HC1G04  [SOT353]
U602  SN74C1G08-DCK  [SC-70-5]
U603  ATTINY25-20SSUR  ATTINY45-SMT-NARROW  [SOIC8]
U604  MIC5205  V_REG_MIC52055V  [SOT23-5]

### Nets
GND: C601.1 C602.- J601.2 J603.6 Q601.1(S) Q601.2(S) Q601.3(S) R602.2 R605.1 R606.1 R607.1 S601.1 S601.2 U601.3(P$V-) U602.3(GND) U603.4(GND) U604.2(GND) ; also sheet 1,2,3,4,5,7,8,9,10,11,12,13,14,15,16
N$5: TP602.TP U601.4(Y) U602.2(B)
N$25: TP604.TP U603.2(PB3(ADC3))
N$55: D604.C R607.2
N$58: D603.C R606.2
N$66: D602.C R605.2
N$73: R601.1 R602.1 TP603.TP U602.4(Y)
N$92: Q601.4(G) R601.2
N$95: D601.A J602.2 Q601.MB(D)
V_BATT: D601.C J602.1 U604.1(IN) U604.3(EN) ; also sheet 1,2,3,4,5,7,8,9,10,11,12,13,14,15,16
WATER_IN: D603.A U602.1(A) ; also sheet 16
WATER_MISO: J603.1 U603.6(PB1(MISO))
WATER_MOSI: J603.4 U603.5(PB0(MOSI))
WATER_OUT: D602.A S602.2(P) U601.2(A) ; also sheet 16
WATER_OUT_SWITCH: S602.3(S) U603.3(PB4(ADC2))
WATER_RST: J603.5 R604.1 S601.3 S601.4 U603.1(PB5(NRES))
WATER_SCK: J601.1 J603.3 R603.1 U603.7(PB2(SCK/ADC1))
WATER_VCC: C601.2 C602.+ D604.A J603.2 R603.2 R604.2 S602.1(O) TP601.TP U601.5(P$V+) U602.5(VCC) U603.8(VCC) U604.5(OUT)
Unconnected: U604.4(BP)

### Notes on the sheet
- A solenoid valve is connected to J45. A mosfet 
  attached to the microcontroller controlls the 
  state of the valve.
- Resistance of saltwater is monitored by split 
  contacts plugged into header J46
- WATER ACTION
- A solenoid valve opens, releasing a small 
  amount of fresh water into a test tube already 
  containing salt water. The salt water level 
  raises, touching two electrodes. The change in 
  resistance is sensed by the microcontroller, 
  which begins the next action.
- "Add water to a closed container so that it 
  completes an electric circuit and begins the 
  next action."

## Sheet 7 of 16: IR
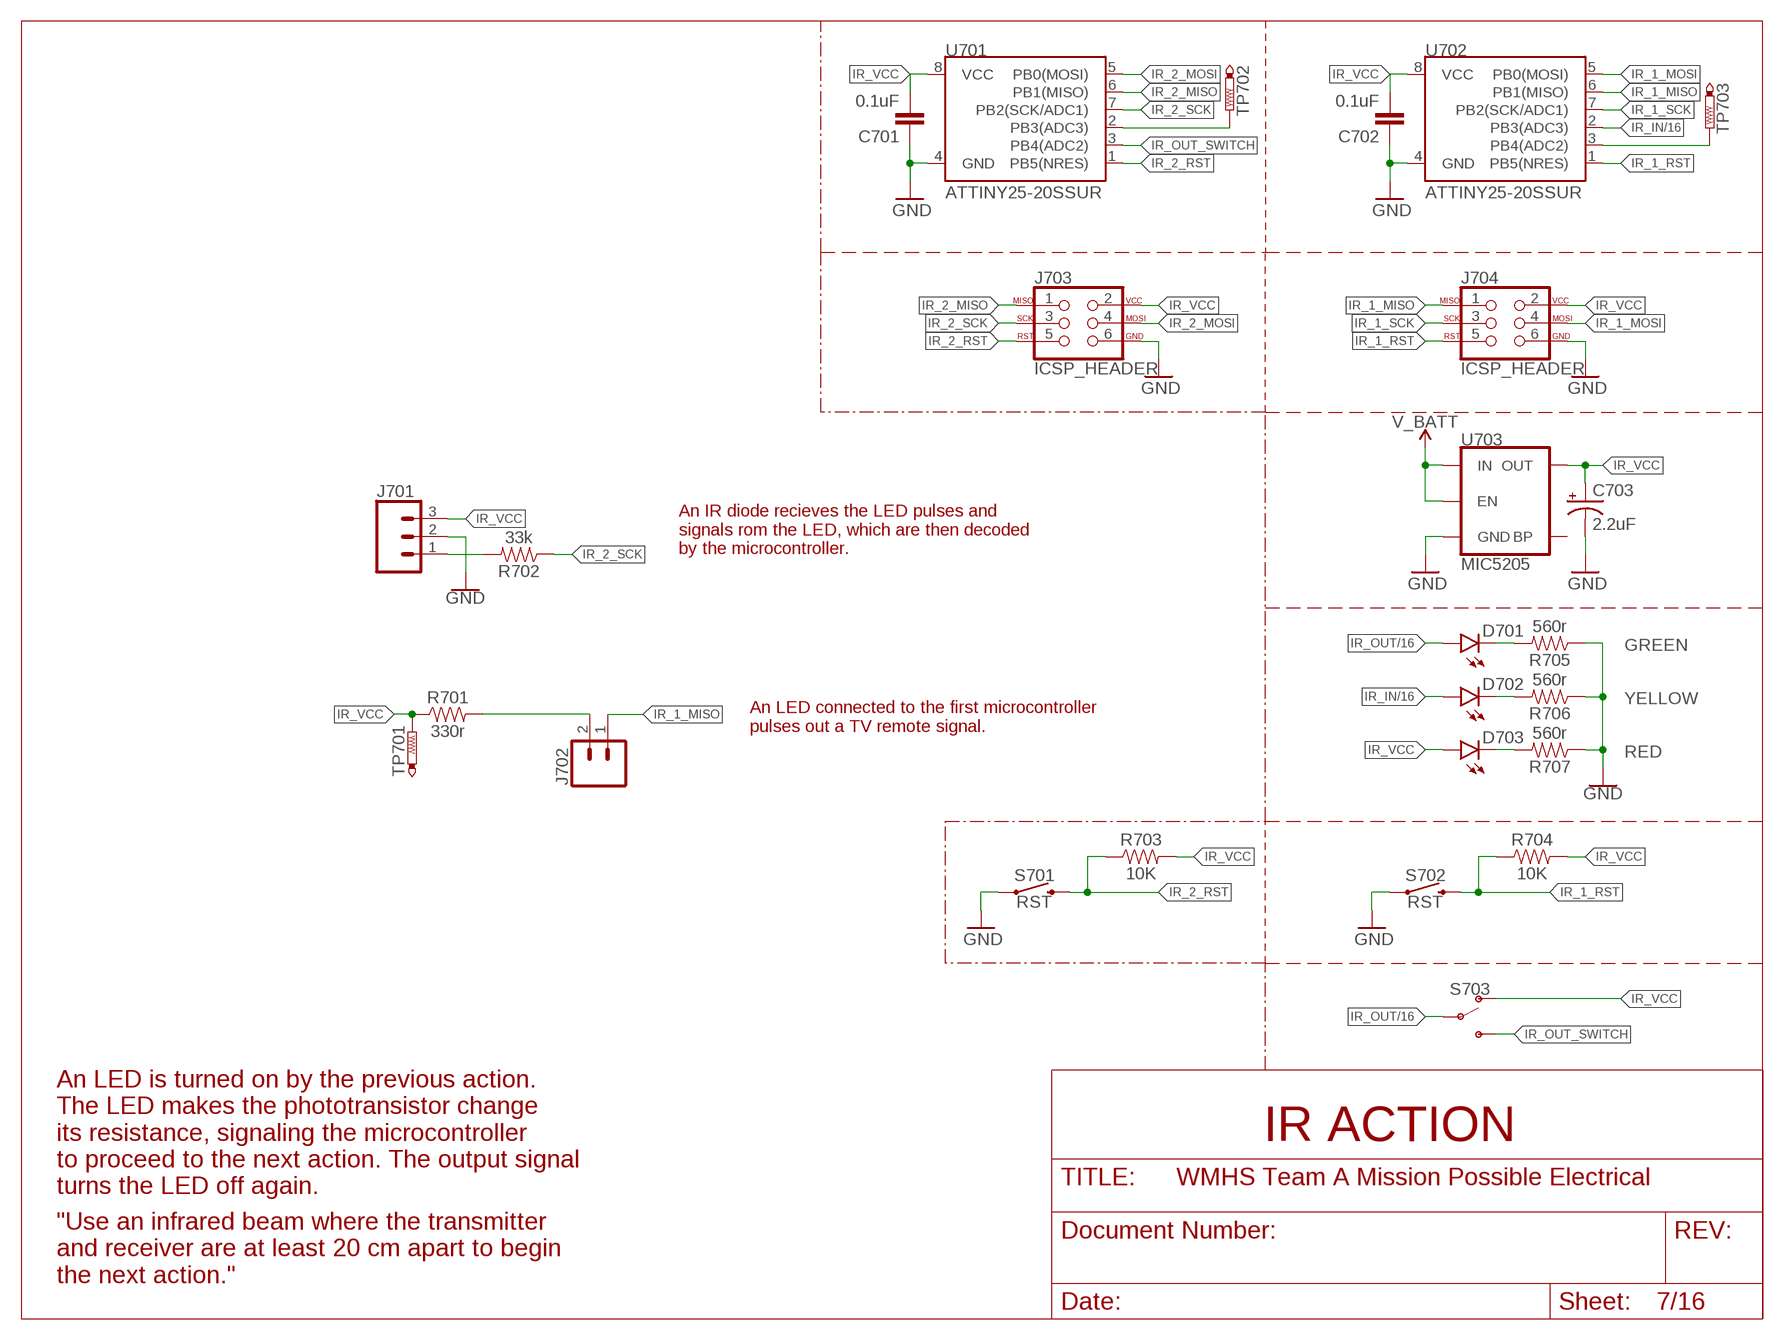
[diagram p6: schematic, sheet 7]

### Parts
C701  0.1uF  0.1UF-0603-25V-5%  [0603]
C702  0.1uF  0.1UF-0603-25V-5%  [0603]
C703  2.2uF  10UF-POLAR-EIA3216-16V-10%(TANT)  [EIA3216]
D701  GREEN  LED-GREEN0603  [LED-0603]
D702  YELLOW  LED-YELLOW0603  [LED-0603]
D703  RED  LED-RED0603  [LED-0603]
J701  CONN_03  [1X03]
J702  CONN_02LOCK  [1X02_LOCK]
J703  ICSP_HEADER  AVR_SPI_PROG_3X2PTH  [2X3]
J704  ICSP_HEADER  AVR_SPI_PROG_3X2PTH  [2X3]
R701  330r  RESISTOR0603  [0603]
R702  33k  RESISTOR0603  [0603]
R703  10K  330OHM-0603-1/10W-1%  [0603]
R704  10K  330OHM-0603-1/10W-1%  [0603]
R705  560r  330OHM-0603-1/10W-1%  [0603]
R706  560r  330OHM-0603-1/10W-1%  [0603]
R707  560r  330OHM-0603-1/10W-1%  [0603]
S701  RST  MOMENTARY-SWITCH-SPST-SMD-5.2-REDUNDANT  [TACTILE_SWITCH_SMD_5.2MM]
S702  RST  MOMENTARY-SWITCH-SPST-SMD-5.2-REDUNDANT  [TACTILE_SWITCH_SMD_5.2MM]
S703  SWITCH-SPDT-SMD-AYZ0202  [SWITCH_DPDT_SMD_AYZ0202]
TP701  PTR1TP20R  [TP20R]
TP702  PTR1TP20R  [TP20R]
TP703  PTR1TP20R  [TP20R]
U701  ATTINY25-20SSUR  ATTINY45-SMT-NARROW  [SOIC8]
U702  ATTINY25-20SSUR  ATTINY45-SMT-NARROW  [SOIC8]
U703  MIC5205  V_REG_MIC52055V  [SOT23-5]

### Nets
GND: C701.1 C702.1 C703.- J701.2 J703.6 J704.6 R705.1 R706.1 R707.1 S701.1 S701.2 S702.1 S702.2 U701.4(GND) U702.4(GND) U703.2(GND) ; also sheet 1,2,3,4,5,6,8,9,10,11,12,13,14,15,16
IR_1_MISO: J702.1 J704.1 U702.6(PB1(MISO))
IR_1_MOSI: J704.4 U702.5(PB0(MOSI))
IR_1_RST: J704.5 R704.1 S702.3 S702.4 U702.1(PB5(NRES))
IR_1_SCK: J704.3 U702.7(PB2(SCK/ADC1))
IR_2_MISO: J703.1 U701.6(PB1(MISO))
IR_2_MOSI: J703.4 U701.5(PB0(MOSI))
IR_2_RST: J703.5 R703.1 S701.3 S701.4 U701.1(PB5(NRES))
IR_2_SCK: J703.3 R702.1 U701.7(PB2(SCK/ADC1))
IR_IN: D702.A U702.2(PB3(ADC3)) ; also sheet 16
IR_OUT: D701.A S703.2(P) ; also sheet 16
IR_OUT_SWITCH: S703.3(S) U701.3(PB4(ADC2))
IR_VCC: C701.2 C702.2 C703.+ D703.A J701.3 J703.2 J704.2 R701.1 R703.2 R704.2 S703.1(O) TP701.TP U701.8(VCC) U702.8(VCC) U703.5(OUT)
N$26: TP702.TP U701.2(PB3(ADC3))
N$27: TP703.TP U702.3(PB4(ADC2))
N$72: D703.C R707.2
N$85: J702.2 R701.2
N$88: J701.1 R702.2
N$96: D702.C R706.2
N$107: D701.C R705.2
V_BATT: U703.1(IN) U703.3(EN) ; also sheet 1,2,3,4,5,6,8,9,10,11,12,13,14,15,16
Unconnected: U703.4(BP)

### Notes on the sheet
- An IR diode recieves the LED pulses and 
  signals rom the LED, which are then decoded 
  by the microcontroller.
- An LED connected to the first microcontroller 
  pulses out a TV remote signal.
- IR ACTION
- An LED is turned on by the previous action. 
  The LED makes the phototransistor change 
  its resistance, signaling the microcontroller 
  to proceed to the next action. The output signal 
  turns the LED off again.
- "Use an infrared beam where the transmitter 
  and receiver are at least 20 cm apart to begin 
  the next action."

## Sheet 8 of 16: Electromagnet
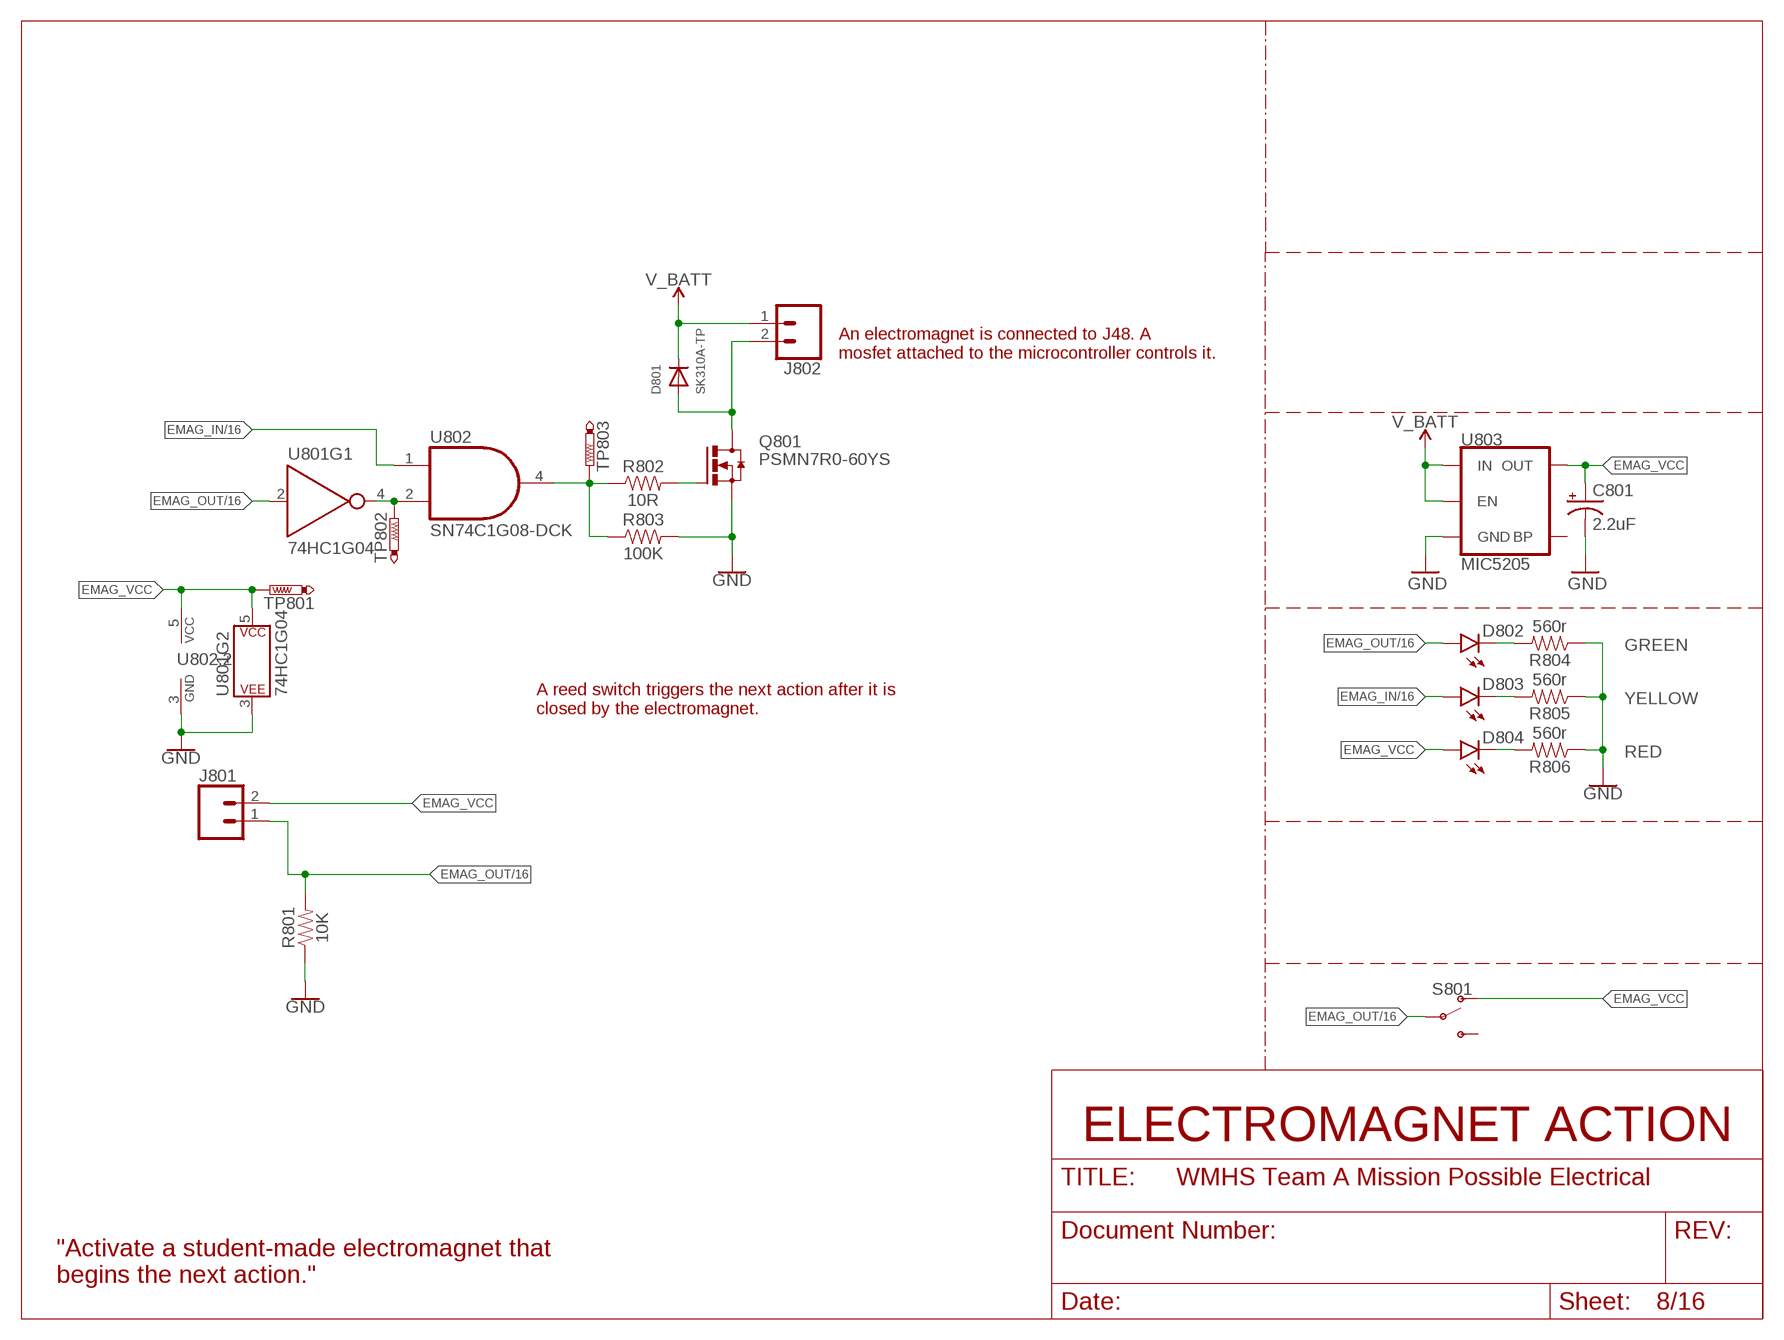
[diagram p7: schematic, sheet 8]

### Parts
C801  2.2uF  10UF-POLAR-EIA3216-16V-10%(TANT)  [EIA3216]
D801  SK310A-TP  DIODESMA  [SMADIODE]
D802  GREEN  LED-GREEN0603  [LED-0603]
D803  YELLOW  LED-YELLOW0603  [LED-0603]
D804  RED  LED-RED0603  [LED-0603]
J801  CONN_02LOCK  [1X02_LOCK]
J802  CONN_023.5MM_LOCK  [SCREWTERMINAL-3.5MM-2_LOCK]
Q801  PSMN7R0-60YS  [SOT669]
R801  10K  RESISTOR0603  [0603]
R802  10R  RESISTOR0603  [0603]
R803  100K  RESISTOR0603  [0603]
R804  560r  330OHM-0603-1/10W-1%  [0603]
R805  560r  330OHM-0603-1/10W-1%  [0603]
R806  560r  330OHM-0603-1/10W-1%  [0603]
S801  SWITCH-SPDT-SMD-AYZ0202  [SWITCH_DPDT_SMD_AYZ0202]
TP801  PTR1TP20R  [TP20R]
TP802  PTR1TP20R  [TP20R]
TP803  PTR1TP20R  [TP20R]
U801  74HC1G04  [SOT353]
U802  SN74C1G08-DCK  [SC-70-5]
U803  MIC5205  V_REG_MIC52055V  [SOT23-5]

### Nets
EMAG_IN: D803.A U802.1(A) ; also sheet 16
EMAG_OUT: D802.A J801.1 R801.2 S801.2(P) U801.2(A) ; also sheet 16
EMAG_VCC: C801.+ D804.A J801.2 S801.1(O) TP801.TP U801.5(P$V+) U802.5(VCC) U803.5(OUT)
GND: C801.- Q801.1(S) Q801.2(S) Q801.3(S) R801.1 R803.2 R804.1 R805.1 R806.1 U801.3(P$V-) U802.3(GND) U803.2(GND) ; also sheet 1,2,3,4,5,6,7,9,10,11,12,13,14,15,16
N$15: TP802.TP U801.4(Y) U802.2(B)
N$21: R802.1 R803.1 TP803.TP U802.4(Y)
N$99: Q801.4(G) R802.2
N$100: D801.A J802.2 Q801.MB(D)
N$108: D804.C R806.2
N$109: D803.C R805.2
N$110: D802.C R804.2
V_BATT: D801.C J802.1 U803.1(IN) U803.3(EN) ; also sheet 1,2,3,4,5,6,7,9,10,11,12,13,14,15,16
Unconnected: S801.3(S) U803.4(BP)

### Notes on the sheet
- An electromagnet is connected to J48. A 
  mosfet attached to the microcontroller controls it.
- A reed switch triggers the next action after it is 
  closed by the electromagnet.
- ELECTROMAGNET ACTION
- "Activate a student-made electromagnet that 
  begins the next action."

## Sheet 9 of 16: Levers
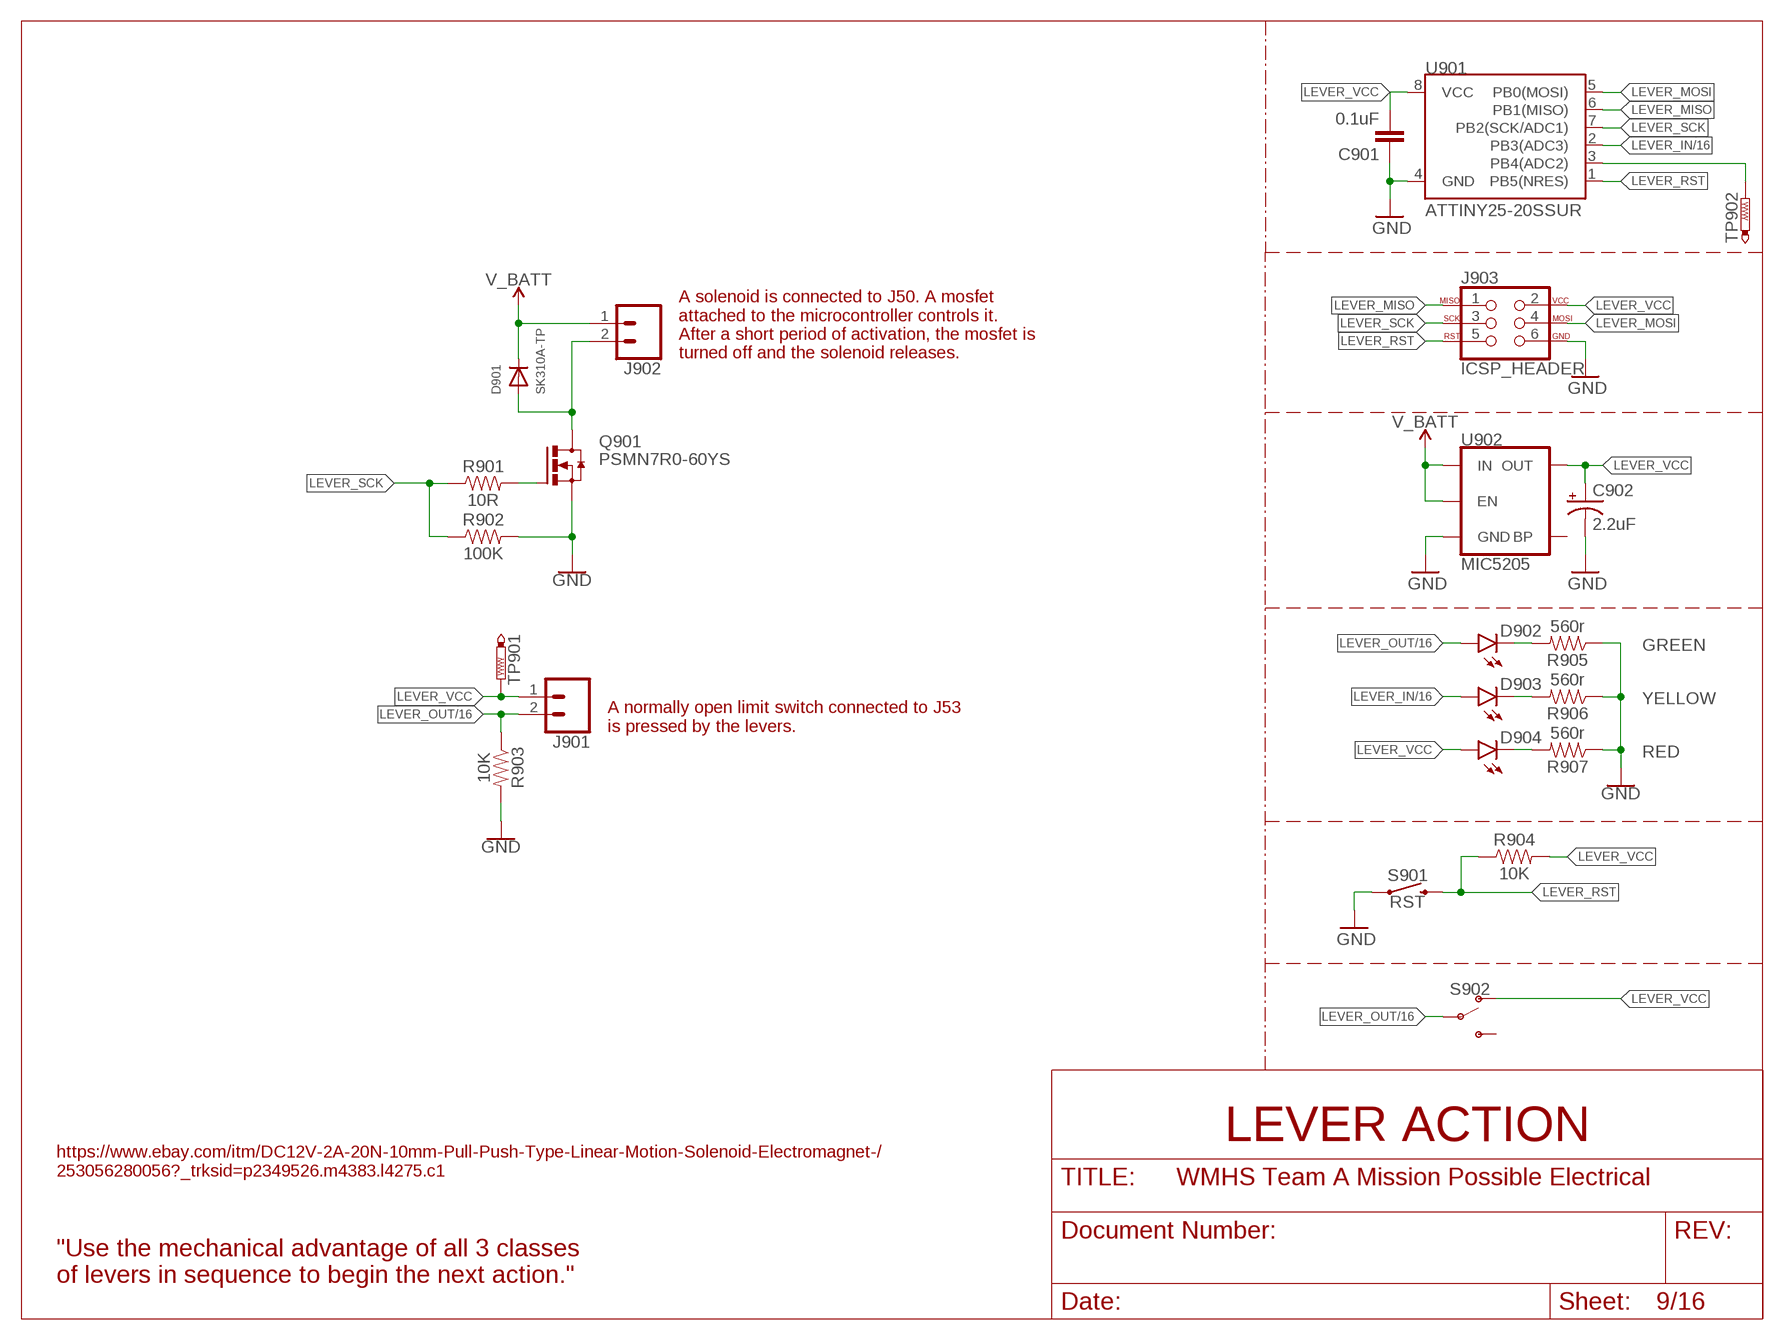
[diagram p8: schematic, sheet 9]

### Parts
C901  0.1uF  0.1UF-0603-25V-5%  [0603]
C902  2.2uF  10UF-POLAR-EIA3216-16V-10%(TANT)  [EIA3216]
D901  SK310A-TP  DIODESMA  [SMADIODE]
D902  GREEN  LED-GREEN0603  [LED-0603]
D903  YELLOW  LED-YELLOW0603  [LED-0603]
D904  RED  LED-RED0603  [LED-0603]
J901  CONN_02LOCK  [1X02_LOCK]
J902  CONN_023.5MM_LOCK  [SCREWTERMINAL-3.5MM-2_LOCK]
J903  ICSP_HEADER  AVR_SPI_PROG_3X2PTH  [2X3]
Q901  PSMN7R0-60YS  [SOT669]
R901  10R  RESISTOR0603  [0603]
R902  100K  RESISTOR0603  [0603]
R903  10K  RESISTOR0603  [0603]
R904  10K  330OHM-0603-1/10W-1%  [0603]
R905  560r  330OHM-0603-1/10W-1%  [0603]
R906  560r  330OHM-0603-1/10W-1%  [0603]
R907  560r  330OHM-0603-1/10W-1%  [0603]
S901  RST  MOMENTARY-SWITCH-SPST-SMD-5.2-REDUNDANT  [TACTILE_SWITCH_SMD_5.2MM]
S902  SWITCH-SPDT-SMD-AYZ0202  [SWITCH_DPDT_SMD_AYZ0202]
TP901  PTR1TP20R  [TP20R]
TP902  PTR1TP20R  [TP20R]
U901  ATTINY25-20SSUR  ATTINY45-SMT-NARROW  [SOIC8]
U902  MIC5205  V_REG_MIC52055V  [SOT23-5]

### Nets
GND: C901.1 C902.- J903.6 Q901.1(S) Q901.2(S) Q901.3(S) R902.2 R903.2 R905.1 R906.1 R907.1 S901.1 S901.2 U901.4(GND) U902.2(GND) ; also sheet 1,2,3,4,5,6,7,8,10,11,12,13,14,15,16
LEVER_IN: D903.A U901.2(PB3(ADC3)) ; also sheet 16
LEVER_MISO: J903.1 U901.6(PB1(MISO))
LEVER_MOSI: J903.4 U901.5(PB0(MOSI))
LEVER_OUT: D902.A J901.2 R903.1 S902.2(P) ; also sheet 16
LEVER_RST: J903.5 R904.1 S901.3 S901.4 U901.1(PB5(NRES))
LEVER_SCK: J903.3 R901.1 R902.1 U901.7(PB2(SCK/ADC1))
LEVER_VCC: C901.2 C902.+ D904.A J901.1 J903.2 R904.2 S902.1(O) TP901.TP U901.8(VCC) U902.5(OUT)
N$28: TP902.TP U901.3(PB4(ADC2))
N$103: Q901.4(G) R901.2
N$104: D901.A J902.2 Q901.MB(D)
N$111: D904.C R907.2
N$112: D903.C R906.2
N$113: D902.C R905.2
V_BATT: D901.C J902.1 U902.1(IN) U902.3(EN) ; also sheet 1,2,3,4,5,6,7,8,10,11,12,13,14,15,16
Unconnected: S902.3(S) U902.4(BP)

### Notes on the sheet
- A solenoid is connected to J50. A mosfet 
  attached to the microcontroller controls it. 
  After a short period of activation, the mosfet is 
  turned off and the solenoid releases.
- A normally open limit switch connected to J53 
  is pressed by the levers.
- LEVER ACTION
- https://www.ebay.com/itm/DC12V-2A-20N-10mm-Pull-Push-Type-Linear-Motion-Solenoid-Electromagnet-/
  253056280056?_trksid=p2349526.m4383.l4275.c1
- "Use the mechanical advantage of all 3 classes 
  of levers in sequence to begin the next action."

## Sheet 10 of 16: Gas Expansion
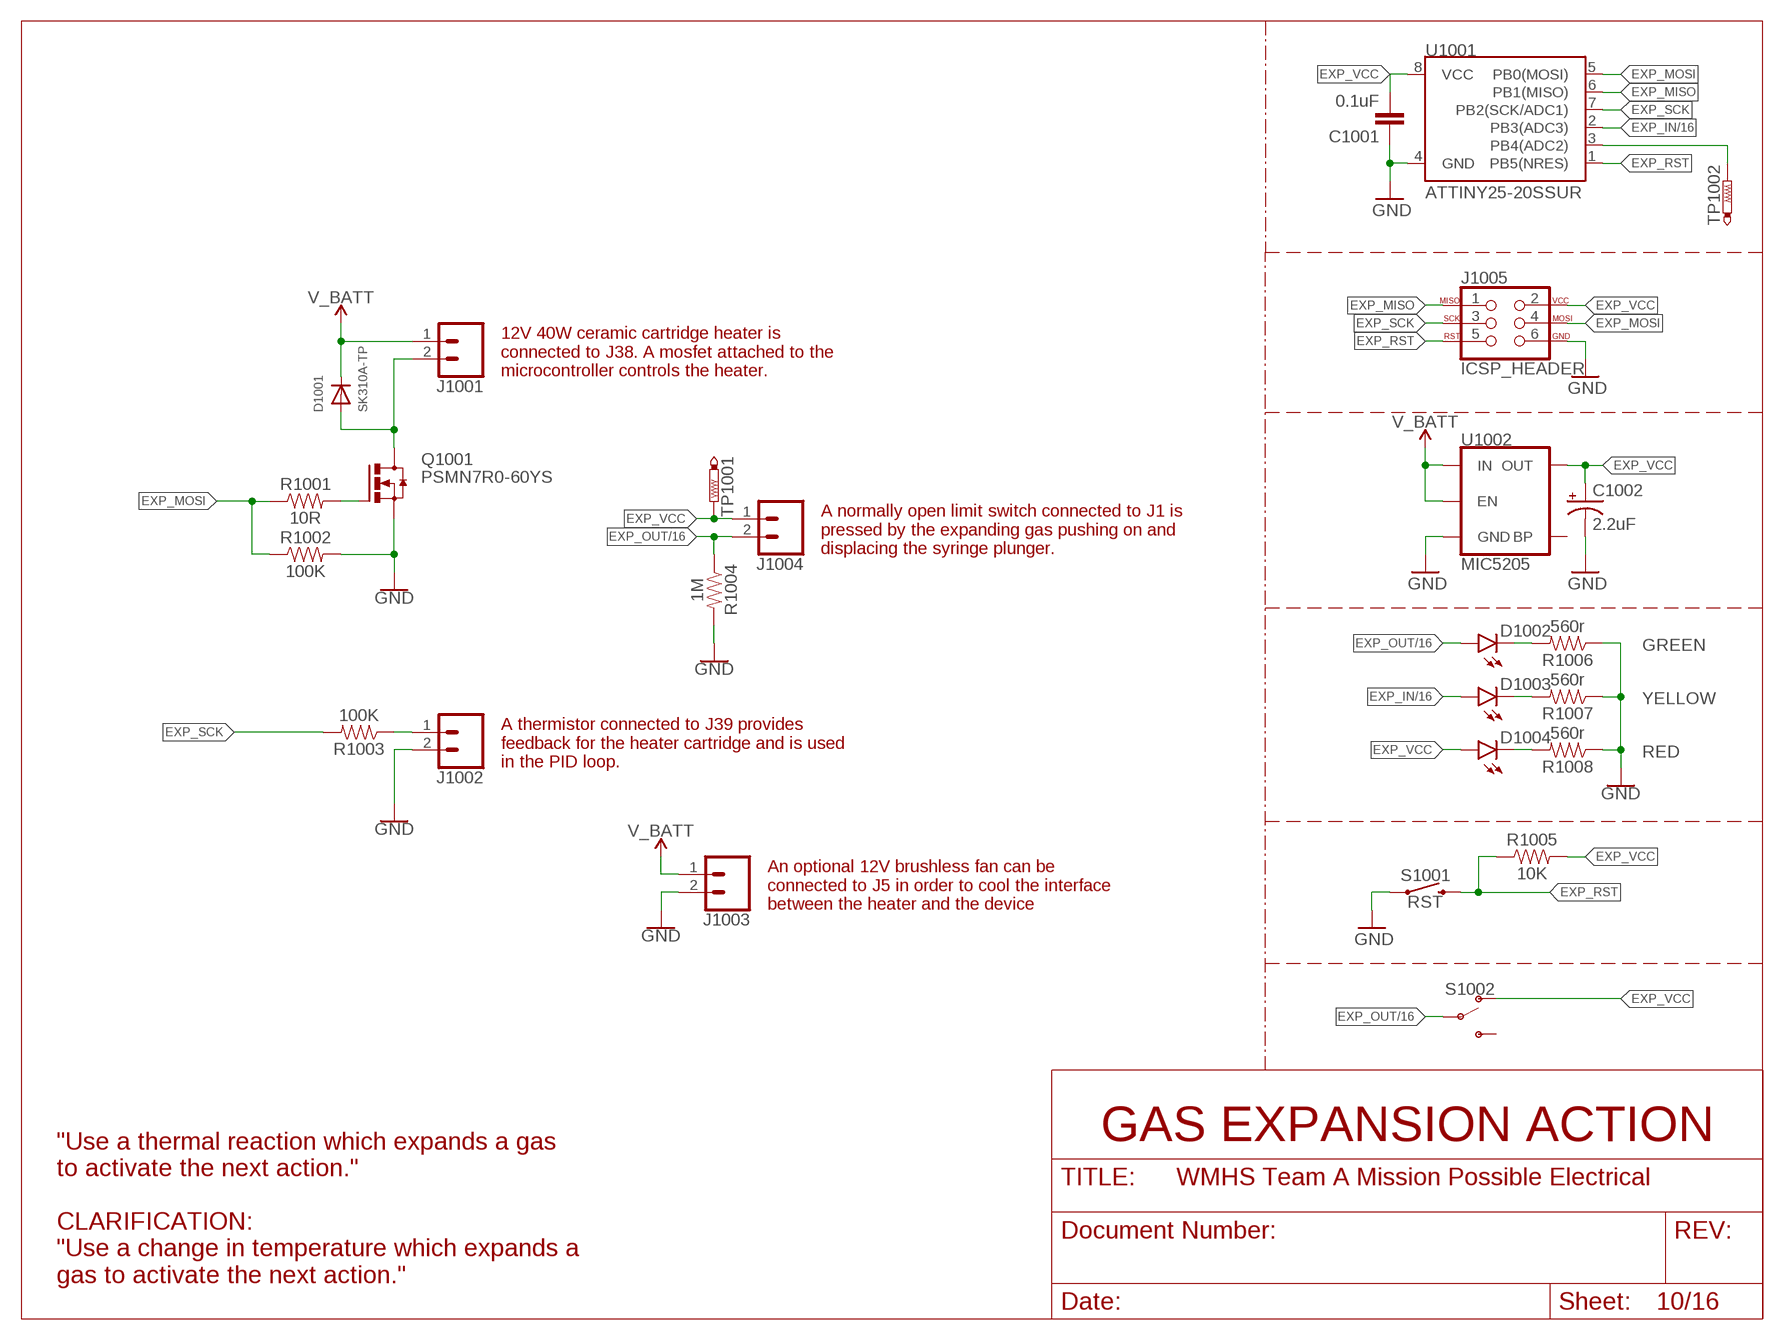
[diagram p9: schematic, sheet 10]

### Parts
C1001  0.1uF  0.1UF-0603-25V-5%  [0603]
C1002  2.2uF  10UF-POLAR-EIA3216-16V-10%(TANT)  [EIA3216]
D1001  SK310A-TP  DIODESMA  [SMADIODE]
D1002  GREEN  LED-GREEN0603  [LED-0603]
D1003  YELLOW  LED-YELLOW0603  [LED-0603]
D1004  RED  LED-RED0603  [LED-0603]
J1001  CONN_023.5MM_LOCK  [SCREWTERMINAL-3.5MM-2_LOCK]
J1002  CONN_02LOCK  [1X02_LOCK]
J1003  CONN_02LOCK  [1X02_LOCK]
J1004  CONN_02LOCK  [1X02_LOCK]
J1005  ICSP_HEADER  AVR_SPI_PROG_3X2PTH  [2X3]
Q1001  PSMN7R0-60YS  [SOT669]
R1001  10R  RESISTOR0603  [0603]
R1002  100K  RESISTOR0603  [0603]
R1003  100K  RESISTOR0603  [0603]
R1004  1M  RESISTOR0603  [0603]
R1005  10K  330OHM-0603-1/10W-1%  [0603]
R1006  560r  330OHM-0603-1/10W-1%  [0603]
R1007  560r  330OHM-0603-1/10W-1%  [0603]
R1008  560r  330OHM-0603-1/10W-1%  [0603]
S1001  RST  MOMENTARY-SWITCH-SPST-SMD-5.2-REDUNDANT  [TACTILE_SWITCH_SMD_5.2MM]
S1002  SWITCH-SPDT-SMD-AYZ0202  [SWITCH_DPDT_SMD_AYZ0202]
TP1001  PTR1TP20R  [TP20R]
TP1002  PTR1TP20R  [TP20R]
U1001  ATTINY25-20SSUR  ATTINY45-SMT-NARROW  [SOIC8]
U1002  MIC5205  V_REG_MIC52055V  [SOT23-5]

### Nets
EXP_IN: D1003.A U1001.2(PB3(ADC3)) ; also sheet 16
EXP_MISO: J1005.1 U1001.6(PB1(MISO))
EXP_MOSI: J1005.4 R1001.1 R1002.1 U1001.5(PB0(MOSI))
EXP_OUT: D1002.A J1004.2 R1004.1 S1002.2(P) ; also sheet 16
EXP_RST: J1005.5 R1005.1 S1001.3 S1001.4 U1001.1(PB5(NRES))
EXP_SCK: J1005.3 R1003.2 U1001.7(PB2(SCK/ADC1))
EXP_VCC: C1001.2 C1002.+ D1004.A J1004.1 J1005.2 R1005.2 S1002.1(O) TP1001.TP U1001.8(VCC) U1002.5(OUT)
GND: C1001.1 C1002.- J1002.2 J1003.2 J1005.6 Q1001.1(S) Q1001.2(S) Q1001.3(S) R1002.2 R1004.2 R1006.1 R1007.1 R1008.1 S1001.1 S1001.2 U1001.4(GND) U1002.2(GND) ; also sheet 1,2,3,4,5,6,7,8,9,11,12,13,14,15,16
N$2: Q1001.4(G) R1001.2
N$29: TP1002.TP U1001.3(PB4(ADC2))
N$53: J1002.1 R1003.1
N$57: D1001.A J1001.2 Q1001.MB(D)
N$114: D1004.C R1008.2
N$115: D1003.C R1007.2
N$116: D1002.C R1006.2
V_BATT: D1001.C J1001.1 J1003.1 U1002.1(IN) U1002.3(EN) ; also sheet 1,2,3,4,5,6,7,8,9,11,12,13,14,15,16
Unconnected: S1002.3(S) U1002.4(BP)

### Notes on the sheet
- 12V 40W ceramic cartridge heater is
  connected to J38. A mosfet attached to the
  microcontroller controls the heater.
- A normally open limit switch connected to J1 is 
  pressed by the expanding gas pushing on and 
  displacing the syringe plunger.
- A thermistor connected to J39 provides 
  feedback for the heater cartridge and is used 
  in the PID loop.
- An optional 12V brushless fan can be 
  connected to J5 in order to cool the interface 
  between the heater and the device
- GAS EXPANSION ACTION
- "Use a thermal reaction which expands a gas 
  to activate the next action."
  
  CLARIFICATION:
  "Use a change in temperature which expands a 
  gas to activate the next action."

## Sheet 11 of 16: Timer
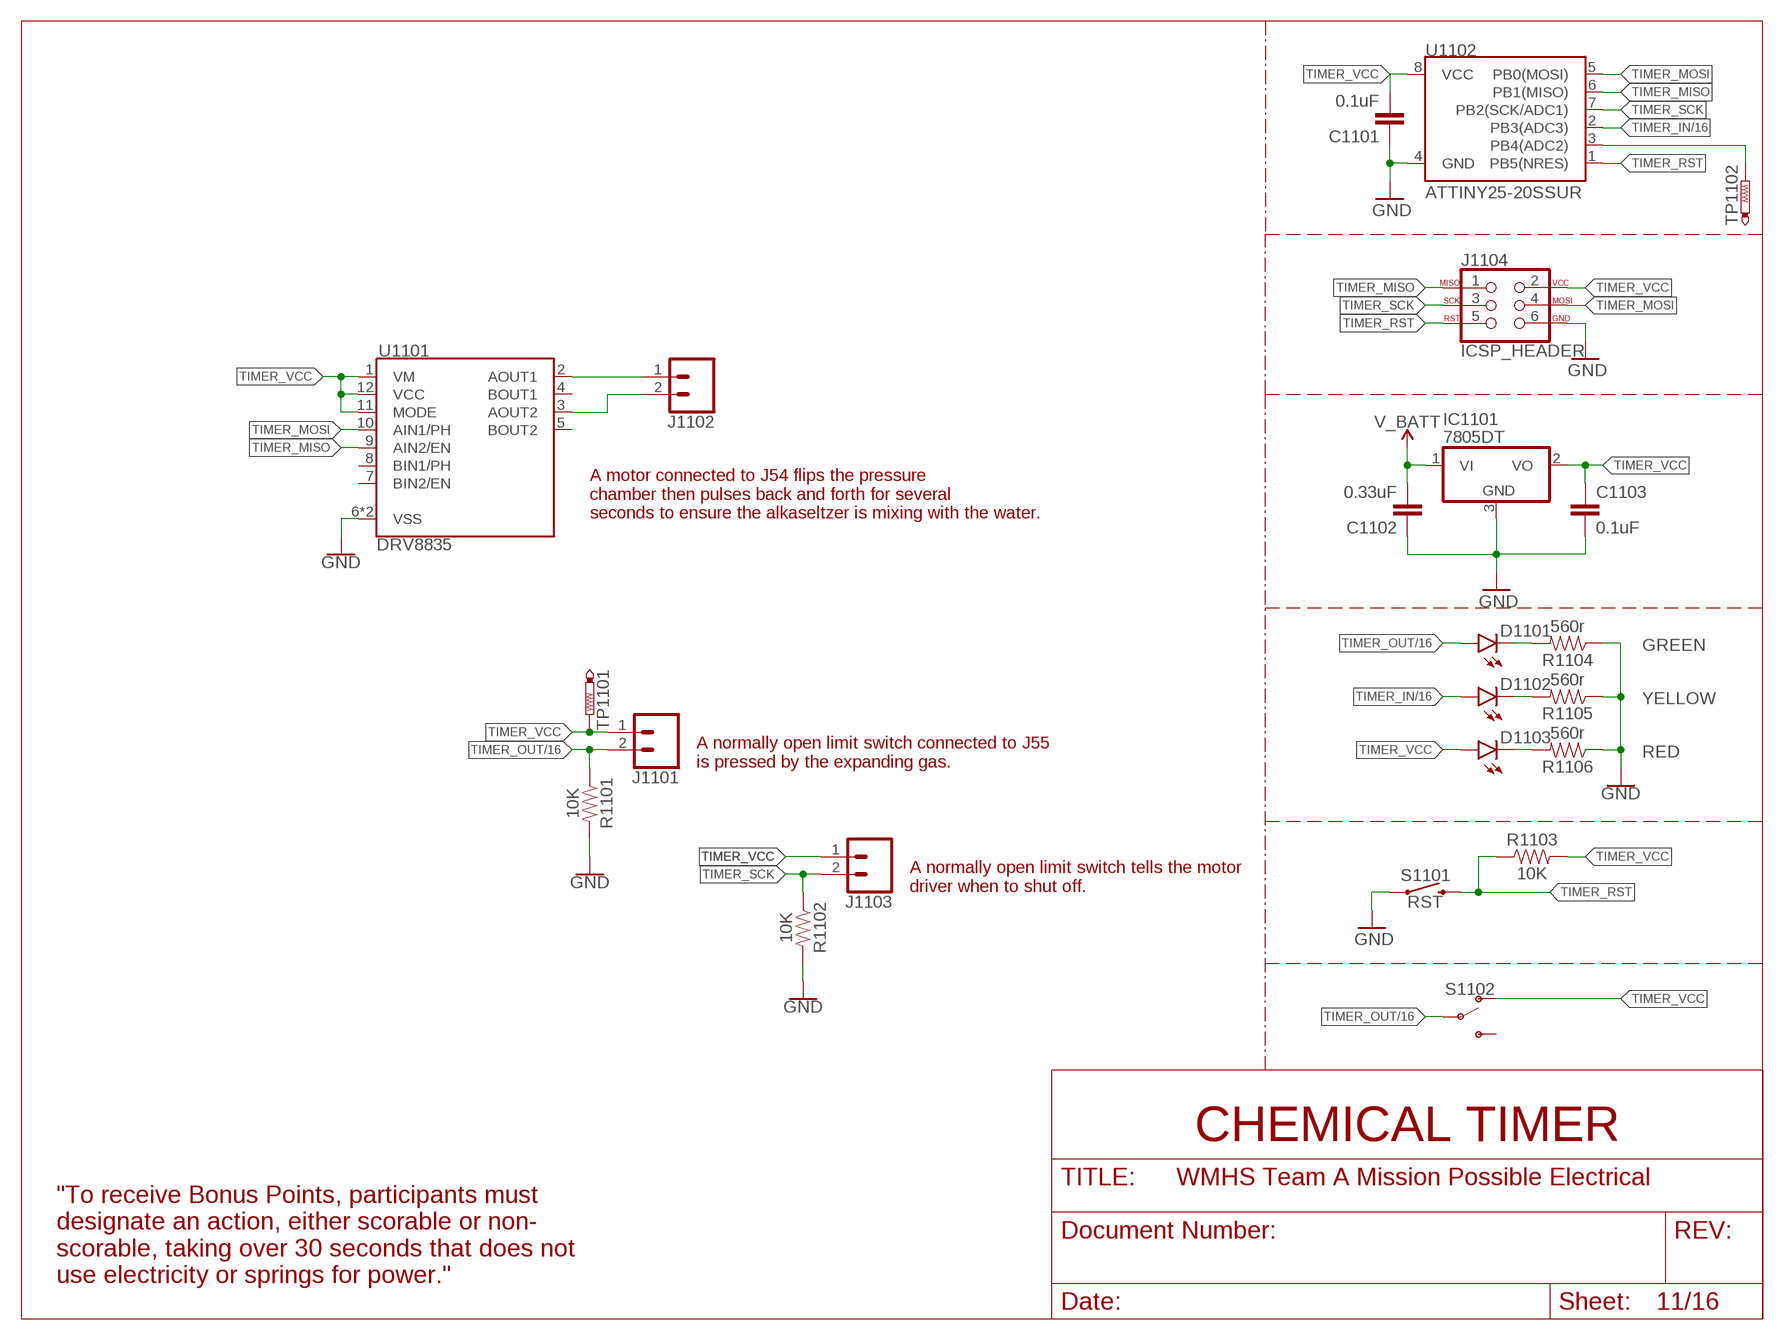
[diagram p10: schematic, sheet 11]

### Parts
C1101  0.1uF  0.1UF-0603-25V-5%  [0603]
C1102  0.33uF  0.1UF-0603-25V-(+80/-20%)  [0603]
C1103  0.1uF  0.1UF-0603-100V-10%  [0603]
D1101  GREEN  LED-GREEN0603  [LED-0603]
D1102  YELLOW  LED-YELLOW0603  [LED-0603]
D1103  RED  LED-RED0603  [LED-0603]
IC1101  7805DT  [TO252]
J1101  CONN_02LOCK  [1X02_LOCK]
J1102  CONN_02LOCK  [1X02_LOCK]
J1103  CONN_02LOCK  [1X02_LOCK]
J1104  ICSP_HEADER  AVR_SPI_PROG_3X2PTH  [2X3]
R1101  10K  RESISTOR0603  [0603]
R1102  10K  RESISTOR0603  [0603]
R1103  10K  330OHM-0603-1/10W-1%  [0603]
R1104  560r  330OHM-0603-1/10W-1%  [0603]
R1105  560r  330OHM-0603-1/10W-1%  [0603]
R1106  560r  330OHM-0603-1/10W-1%  [0603]
S1101  RST  MOMENTARY-SWITCH-SPST-SMD-5.2-REDUNDANT  [TACTILE_SWITCH_SMD_5.2MM]
S1102  SWITCH-SPDT-SMD-AYZ0202  [SWITCH_DPDT_SMD_AYZ0202]
TP1101  PTR1TP20R  [TP20R]
TP1102  PTR1TP20R  [TP20R]
U1101  DRV8835  DRV883X  [WSON-12]
U1102  ATTINY25-20SSUR  ATTINY45-SMT-NARROW  [SOIC8]

### Nets
GND: C1101.1 C1102.1 C1103.2 IC1101.3(GND) J1104.6 R1101.2 R1102.2 R1104.1 R1105.1 R1106.1 S1101.1 S1101.2 U1101.6(VSS) U1101.PAD(VSS) U1102.4(GND) ; also sheet 1,2,3,4,5,6,7,8,9,10,12,13,14,15,16
N$30: TP1102.TP U1102.3(PB4(ADC2))
N$105: J1102.1 U1101.2(AOUT1)
N$106: J1102.2 U1101.3(AOUT2)
N$117: D1103.C R1106.2
N$118: D1102.C R1105.2
N$119: D1101.C R1104.2
TIMER_IN: D1102.A U1102.2(PB3(ADC3)) ; also sheet 16
TIMER_MISO: J1104.1 U1101.9(AIN2/EN) U1102.6(PB1(MISO))
TIMER_MOSI: J1104.4 U1101.10(AIN1/PH) U1102.5(PB0(MOSI))
TIMER_OUT: D1101.A J1101.2 R1101.1 S1102.2(P) ; also sheet 16
TIMER_RST: J1104.5 R1103.1 S1101.3 S1101.4 U1102.1(PB5(NRES))
TIMER_SCK: J1103.2 J1104.3 R1102.1 U1102.7(PB2(SCK/ADC1))
TIMER_VCC: C1101.2 C1103.1 D1103.A IC1101.2(VO) J1101.1 J1103.1 J1104.2 R1103.2 S1102.1(O) TP1101.TP U1101.1(VM) U1101.11(MODE) U1101.12(VCC) U1102.8(VCC)
V_BATT: C1102.2 IC1101.1(VI) ; also sheet 1,2,3,4,5,6,7,8,9,10,12,13,14,15,16
Unconnected: S1102.3(S) U1101.4(BOUT1) U1101.5(BOUT2) U1101.7(BIN2/EN) U1101.8(BIN1/PH)

### Notes on the sheet
- A motor connected to J54 flips the pressure 
  chamber then pulses back and forth for several 
  seconds to ensure the alkaseltzer is mixing with the water.
- A normally open limit switch connected to J55 
  is pressed by the expanding gas.
- A normally open limit switch tells the motor 
  driver when to shut off.
- CHEMICAL TIMER
- "To receive Bonus Points, participants must 
  designate an action, either scorable or non-
  scorable, taking over 30 seconds that does not 
  use electricity or springs for power."

## Sheet 12 of 16: Balloon
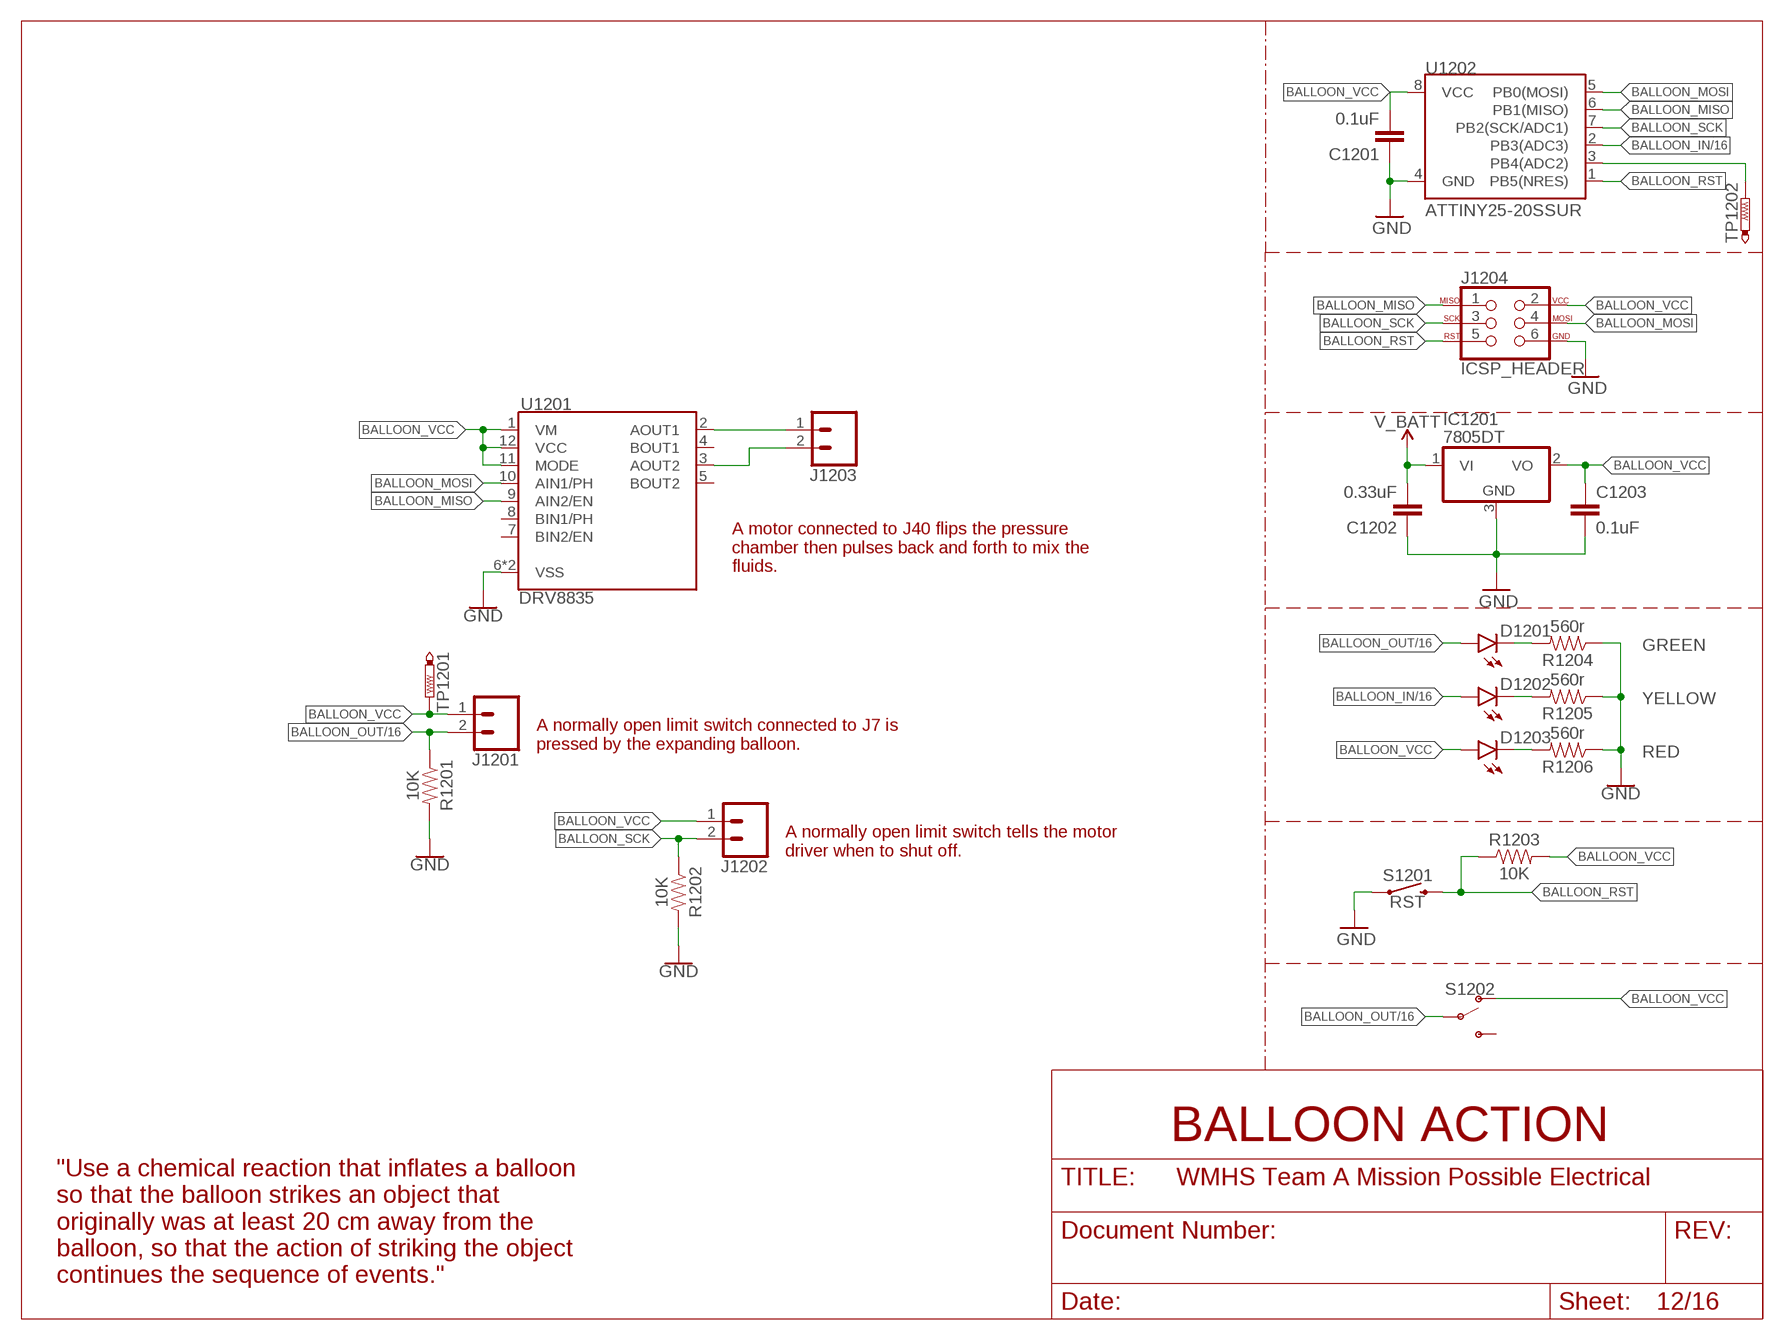
[diagram p11: schematic, sheet 12]

### Parts
C1201  0.1uF  0.1UF-0603-25V-5%  [0603]
C1202  0.33uF  0.1UF-0603-25V-(+80/-20%)  [0603]
C1203  0.1uF  0.1UF-0603-25V-(+80/-20%)  [0603]
D1201  GREEN  LED-GREEN0603  [LED-0603]
D1202  YELLOW  LED-YELLOW0603  [LED-0603]
D1203  RED  LED-RED0603  [LED-0603]
IC1201  7805DT  [TO252]
J1201  CONN_02LOCK  [1X02_LOCK]
J1202  CONN_02LOCK  [1X02_LOCK]
J1203  CONN_02LOCK  [1X02_LOCK]
J1204  ICSP_HEADER  AVR_SPI_PROG_3X2PTH  [2X3]
R1201  10K  RESISTOR0603  [0603]
R1202  10K  RESISTOR0603  [0603]
R1203  10K  330OHM-0603-1/10W-1%  [0603]
R1204  560r  330OHM-0603-1/10W-1%  [0603]
R1205  560r  330OHM-0603-1/10W-1%  [0603]
R1206  560r  330OHM-0603-1/10W-1%  [0603]
S1201  RST  MOMENTARY-SWITCH-SPST-SMD-5.2-REDUNDANT  [TACTILE_SWITCH_SMD_5.2MM]
S1202  SWITCH-SPDT-SMD-AYZ0202  [SWITCH_DPDT_SMD_AYZ0202]
TP1201  PTR1TP20R  [TP20R]
TP1202  PTR1TP20R  [TP20R]
U1201  DRV8835  DRV883X  [WSON-12]
U1202  ATTINY25-20SSUR  ATTINY45-SMT-NARROW  [SOIC8]

### Nets
BALLOON_IN: D1202.A U1202.2(PB3(ADC3)) ; also sheet 16
BALLOON_MISO: J1204.1 U1201.9(AIN2/EN) U1202.6(PB1(MISO))
BALLOON_MOSI: J1204.4 U1201.10(AIN1/PH) U1202.5(PB0(MOSI))
BALLOON_OUT: D1201.A J1201.2 R1201.1 S1202.2(P) ; also sheet 16
BALLOON_RST: J1204.5 R1203.1 S1201.3 S1201.4 U1202.1(PB5(NRES))
BALLOON_SCK: J1202.2 J1204.3 R1202.1 U1202.7(PB2(SCK/ADC1))
BALLOON_VCC: C1201.2 C1203.1 D1203.A IC1201.2(VO) J1201.1 J1202.1 J1204.2 R1203.2 S1202.1(O) TP1201.TP U1201.1(VM) U1201.11(MODE) U1201.12(VCC) U1202.8(VCC)
GND: C1201.1 C1202.1 C1203.2 IC1201.3(GND) J1204.6 R1201.2 R1202.2 R1204.1 R1205.1 R1206.1 S1201.1 S1201.2 U1201.6(VSS) U1201.PAD(VSS) U1202.4(GND) ; also sheet 1,2,3,4,5,6,7,8,9,10,11,13,14,15,16
N$31: TP1202.TP U1202.3(PB4(ADC2))
N$89: J1203.1 U1201.2(AOUT1)
N$90: J1203.2 U1201.3(AOUT2)
N$120: D1203.C R1206.2
N$121: D1202.C R1205.2
N$122: D1201.C R1204.2
V_BATT: C1202.2 IC1201.1(VI) ; also sheet 1,2,3,4,5,6,7,8,9,10,11,13,14,15,16
Unconnected: S1202.3(S) U1201.4(BOUT1) U1201.5(BOUT2) U1201.7(BIN2/EN) U1201.8(BIN1/PH)

### Notes on the sheet
- A motor connected to J40 flips the pressure 
  chamber then pulses back and forth to mix the 
  fluids.
- A normally open limit switch connected to J7 is 
  pressed by the expanding balloon.
- A normally open limit switch tells the motor 
  driver when to shut off.
- BALLOON ACTION
- "Use a chemical reaction that inflates a balloon 
  so that the balloon strikes an object that 
  originally was at least 20 cm away from the 
  balloon, so that the action of striking the object 
  continues the sequence of events."

## Sheet 13 of 16: IMA7
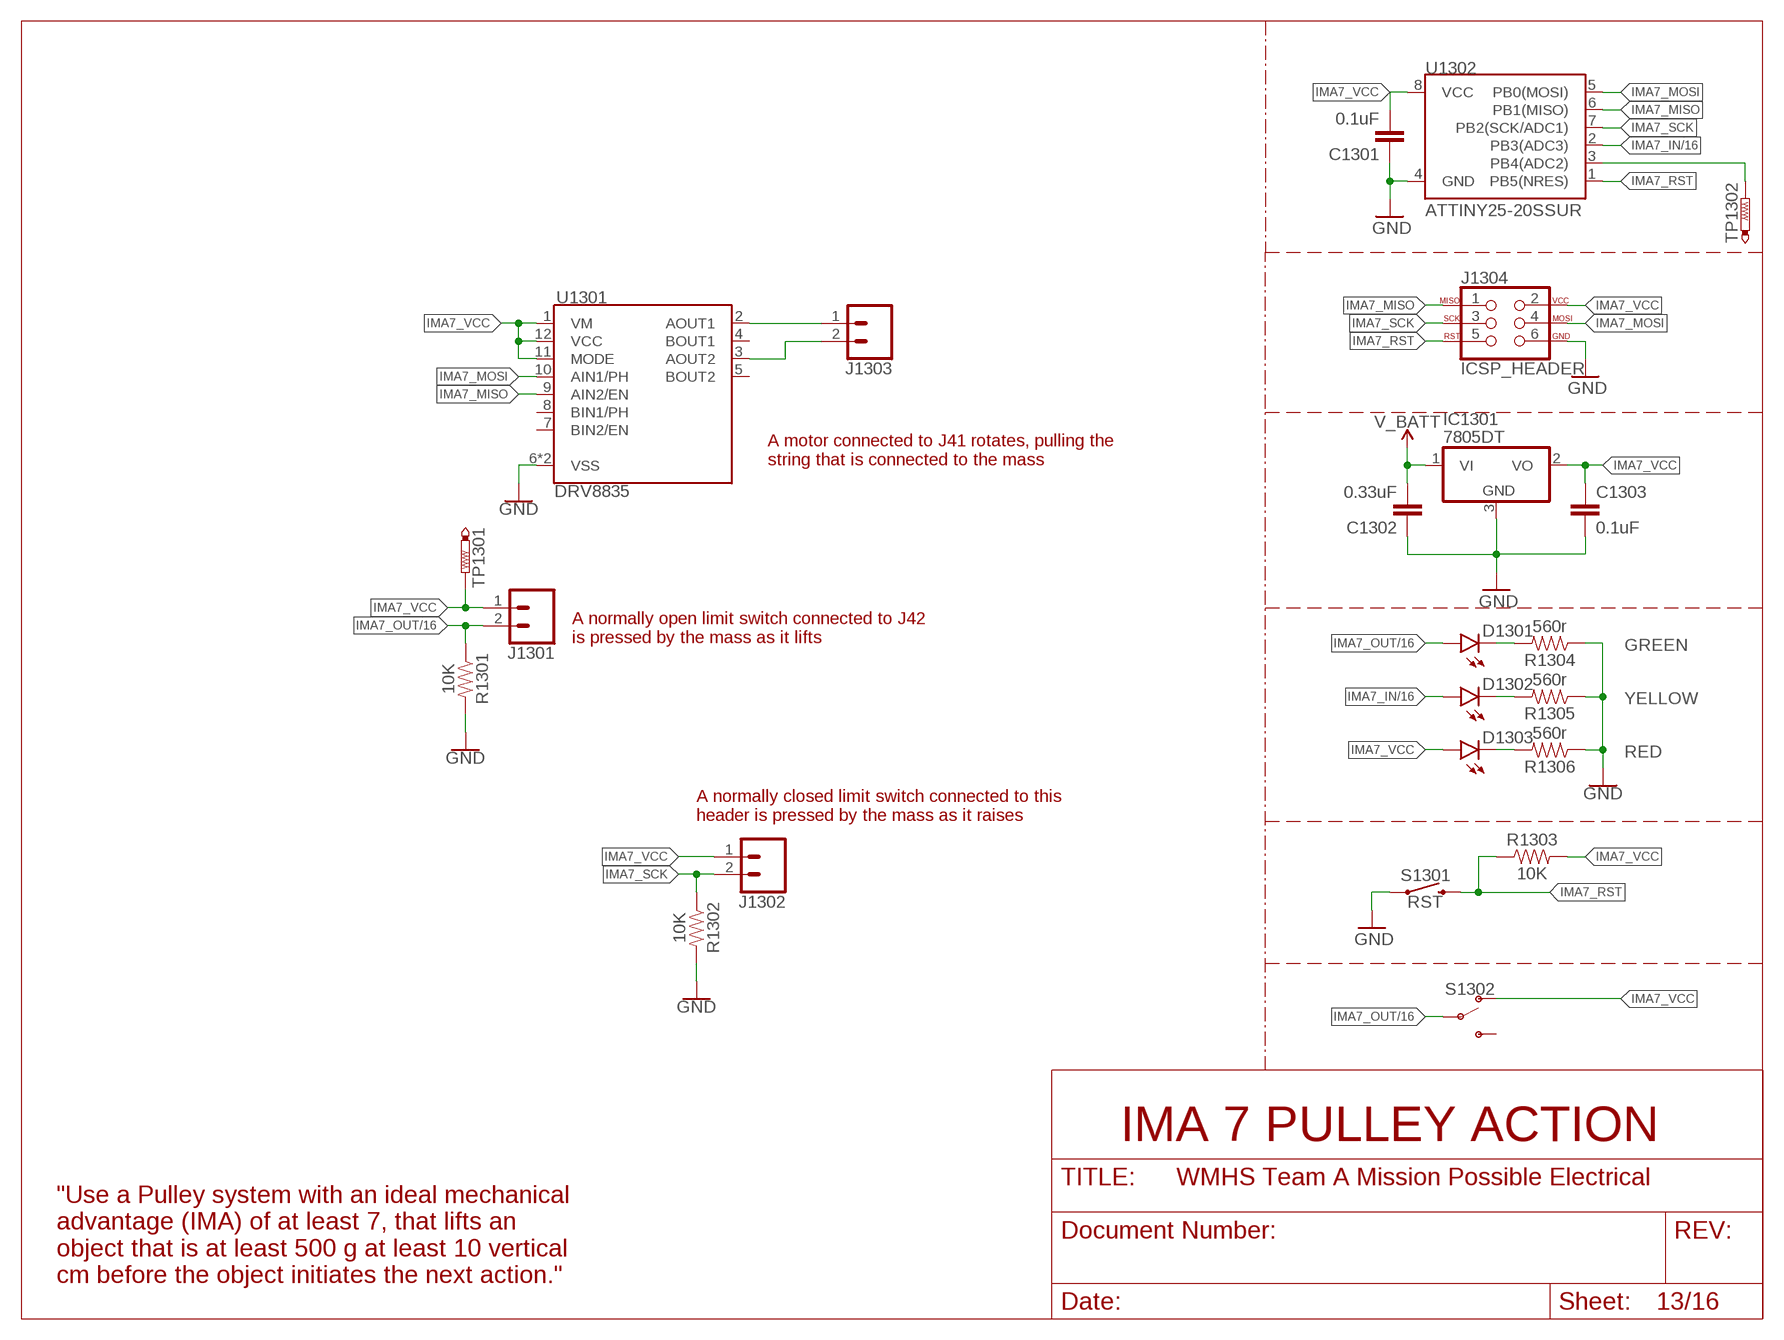
[diagram p12: schematic, sheet 13]

### Parts
C1301  0.1uF  0.1UF-0603-25V-5%  [0603]
C1302  0.33uF  0.1UF-0603-25V-(+80/-20%)  [0603]
C1303  0.1uF  0.1UF-0603-25V-(+80/-20%)  [0603]
D1301  GREEN  LED-GREEN0603  [LED-0603]
D1302  YELLOW  LED-YELLOW0603  [LED-0603]
D1303  RED  LED-RED0603  [LED-0603]
IC1301  7805DT  [TO252]
J1301  CONN_02LOCK  [1X02_LOCK]
J1302  CONN_02LOCK  [1X02_LOCK]
J1303  CONN_02LOCK  [1X02_LOCK]
J1304  ICSP_HEADER  AVR_SPI_PROG_3X2PTH  [2X3]
R1301  10K  RESISTOR0603  [0603]
R1302  10K  RESISTOR0603  [0603]
R1303  10K  330OHM-0603-1/10W-1%  [0603]
R1304  560r  330OHM-0603-1/10W-1%  [0603]
R1305  560r  330OHM-0603-1/10W-1%  [0603]
R1306  560r  330OHM-0603-1/10W-1%  [0603]
S1301  RST  MOMENTARY-SWITCH-SPST-SMD-5.2-REDUNDANT  [TACTILE_SWITCH_SMD_5.2MM]
S1302  SWITCH-SPDT-SMD-AYZ0202  [SWITCH_DPDT_SMD_AYZ0202]
TP1301  PTR1TP20R  [TP20R]
TP1302  PTR1TP20R  [TP20R]
U1301  DRV8835  DRV883X  [WSON-12]
U1302  ATTINY25-20SSUR  ATTINY45-SMT-NARROW  [SOIC8]

### Nets
GND: C1301.1 C1302.1 C1303.2 IC1301.3(GND) J1304.6 R1301.2 R1302.2 R1304.1 R1305.1 R1306.1 S1301.1 S1301.2 U1301.6(VSS) U1301.PAD(VSS) U1302.4(GND) ; also sheet 1,2,3,4,5,6,7,8,9,10,11,12,14,15,16
IMA7_IN: D1302.A U1302.2(PB3(ADC3)) ; also sheet 16
IMA7_MISO: J1304.1 U1301.9(AIN2/EN) U1302.6(PB1(MISO))
IMA7_MOSI: J1304.4 U1301.10(AIN1/PH) U1302.5(PB0(MOSI))
IMA7_OUT: D1301.A J1301.2 R1301.1 S1302.2(P) ; also sheet 16
IMA7_RST: J1304.5 R1303.1 S1301.3 S1301.4 U1302.1(PB5(NRES))
IMA7_SCK: J1302.2 J1304.3 R1302.1 U1302.7(PB2(SCK/ADC1))
IMA7_VCC: C1301.2 C1303.1 D1303.A IC1301.2(VO) J1301.1 J1302.1 J1304.2 R1303.2 S1302.1(O) TP1301.TP U1301.1(VM) U1301.11(MODE) U1301.12(VCC) U1302.8(VCC)
N$32: TP1302.TP U1302.3(PB4(ADC2))
N$87: J1303.1 U1301.2(AOUT1)
N$91: J1303.2 U1301.3(AOUT2)
N$123: D1303.C R1306.2
N$124: D1302.C R1305.2
N$125: D1301.C R1304.2
V_BATT: C1302.2 IC1301.1(VI) ; also sheet 1,2,3,4,5,6,7,8,9,10,11,12,14,15,16
Unconnected: S1302.3(S) U1301.4(BOUT1) U1301.5(BOUT2) U1301.7(BIN2/EN) U1301.8(BIN1/PH)

### Notes on the sheet
- A motor connected to J41 rotates, pulling the 
  string that is connected to the mass
- A normally open limit switch connected to J42 
  is pressed by the mass as it lifts
- A normally closed limit switch connected to this 
  header is pressed by the mass as it raises
- IMA 7 PULLEY ACTION
- "Use a Pulley system with an ideal mechanical 
  advantage (IMA) of at least 7, that lifts an 
  object that is at least 500 g at least 10 vertical 
  cm before the object initiates the next action."

## Sheet 14 of 16: IMA0.5
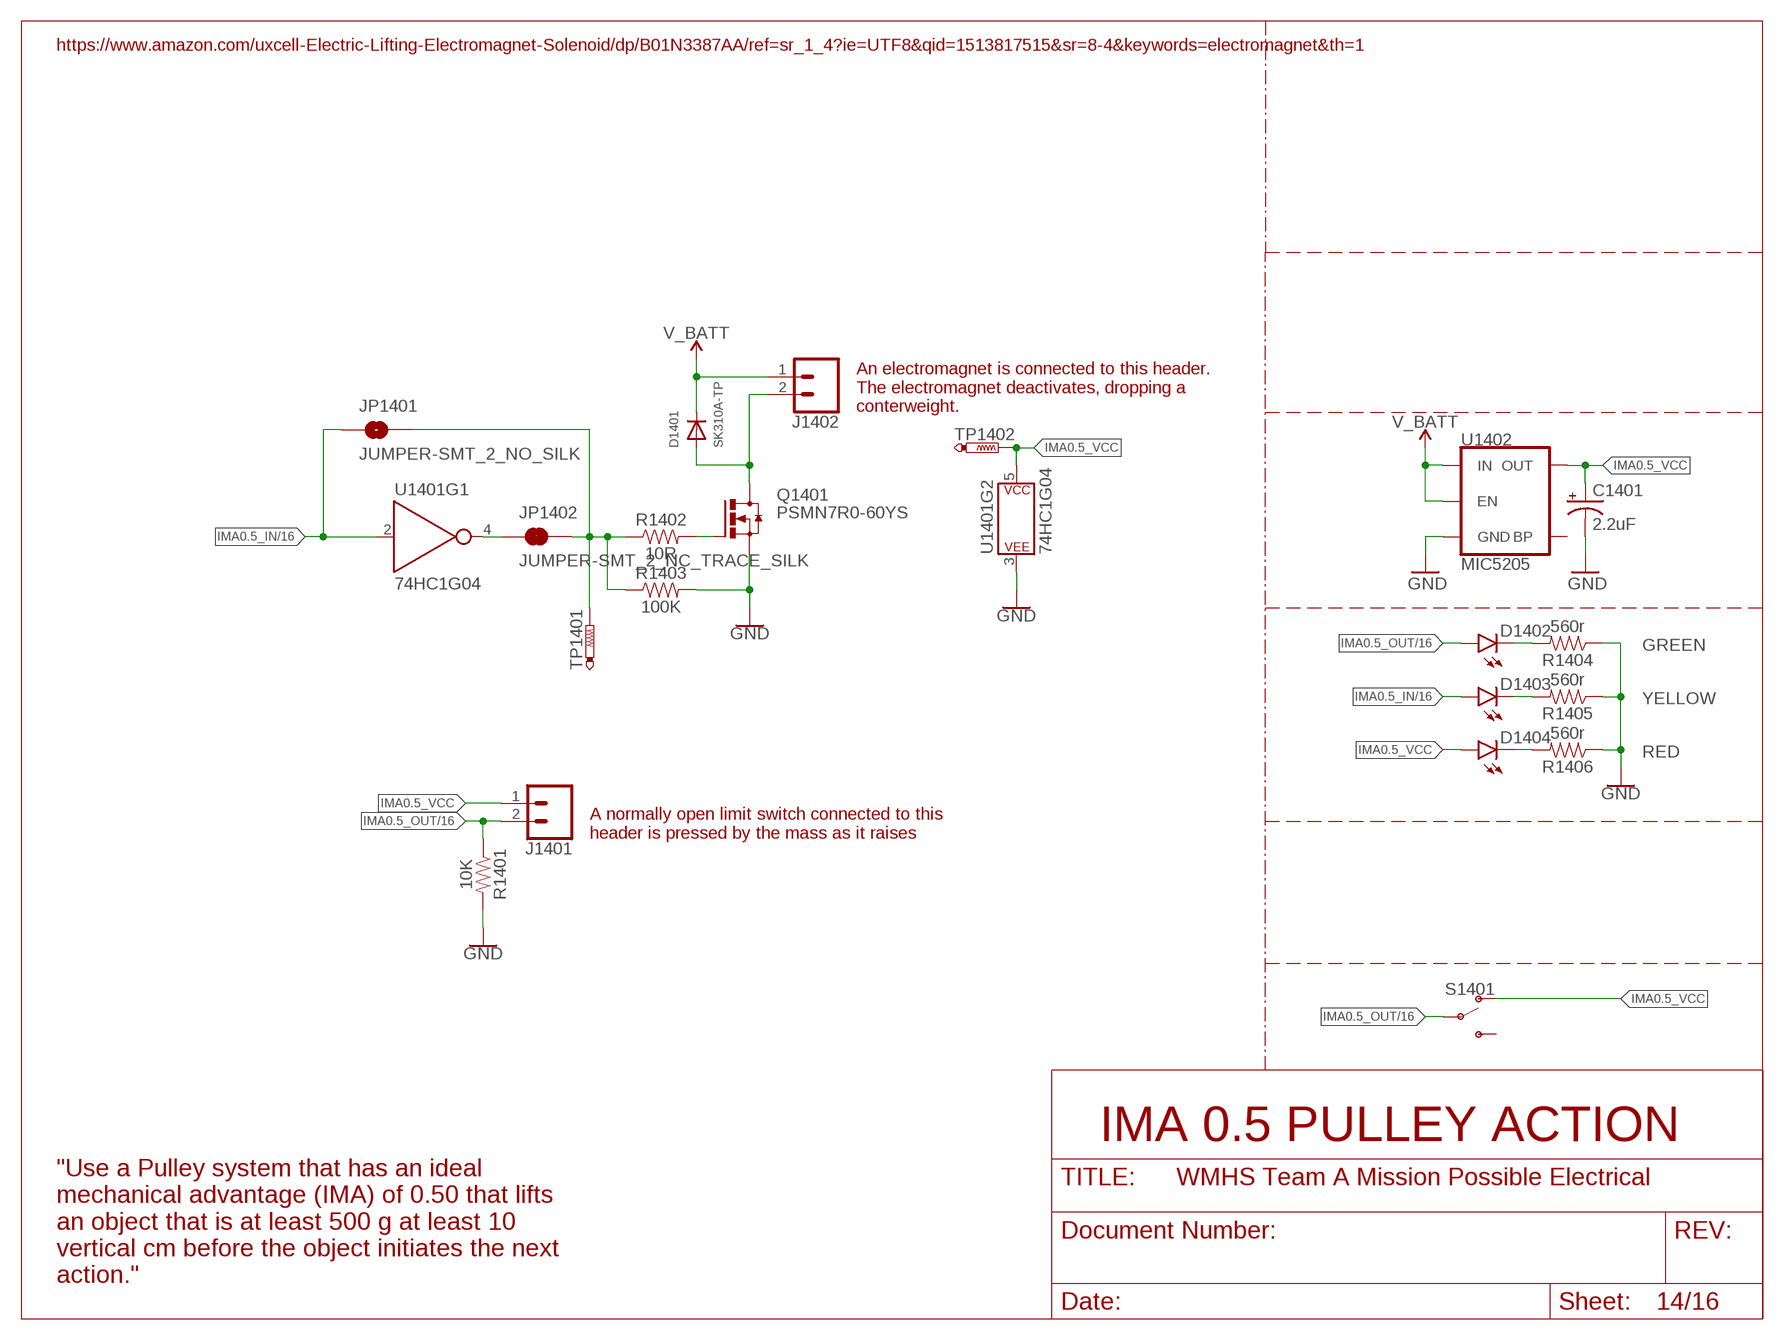
[diagram p13: schematic, sheet 14]

### Parts
C1401  2.2uF  10UF-POLAR-EIA3216-16V-10%(TANT)  [EIA3216]
D1401  SK310A-TP  DIODESMA  [SMADIODE]
D1402  GREEN  LED-GREEN0603  [LED-0603]
D1403  YELLOW  LED-YELLOW0603  [LED-0603]
D1404  RED  LED-RED0603  [LED-0603]
J1401  CONN_02LOCK  [1X02_LOCK]
J1402  CONN_023.5MM_LOCK  [SCREWTERMINAL-3.5MM-2_LOCK]
JP1401  JUMPER-SMT_2_NO_SILK  [SMT-JUMPER_2_NO_SILK]
JP1402  JUMPER-SMT_2_NC_TRACE_SILK  [SMT-JUMPER_2_NC_TRACE_SILK]
Q1401  PSMN7R0-60YS  [SOT669]
R1401  10K  RESISTOR0603  [0603]
R1402  10R  RESISTOR0603  [0603]
R1403  100K  RESISTOR0603  [0603]
R1404  560r  330OHM-0603-1/10W-1%  [0603]
R1405  560r  330OHM-0603-1/10W-1%  [0603]
R1406  560r  330OHM-0603-1/10W-1%  [0603]
S1401  SWITCH-SPDT-SMD-AYZ0202  [SWITCH_DPDT_SMD_AYZ0202]
TP1401  PTR1TP20R  [TP20R]
TP1402  PTR1TP20R  [TP20R]
U1401  74HC1G04  [SOT353]
U1402  MIC5205  V_REG_MIC52055V  [SOT23-5]

### Nets
GND: C1401.- Q1401.1(S) Q1401.2(S) Q1401.3(S) R1401.2 R1403.2 R1404.1 R1405.1 R1406.1 U1401.3(P$V-) U1402.2(GND) ; also sheet 1,2,3,4,5,6,7,8,9,10,11,12,13,15,16
IMA0.5_IN: D1403.A JP1401.1 U1401.2(A) ; also sheet 16
IMA0.5_OUT: D1402.A J1401.2 R1401.1 S1401.2(P) ; also sheet 16
IMA0.5_VCC: C1401.+ D1404.A J1401.1 S1401.1(O) TP1402.TP U1401.5(P$V+) U1402.5(OUT)
N$14: JP1401.2 JP1402.2 R1402.1 R1403.1 TP1401.TP
N$18: JP1402.1 U1401.4(Y)
N$93: Q1401.4(G) R1402.2
N$94: D1401.A J1402.2 Q1401.MB(D)
N$126: D1404.C R1406.2
N$127: D1403.C R1405.2
N$128: D1402.C R1404.2
V_BATT: D1401.C J1402.1 U1402.1(IN) U1402.3(EN) ; also sheet 1,2,3,4,5,6,7,8,9,10,11,12,13,15,16
Unconnected: S1401.3(S) U1402.4(BP)

### Notes on the sheet
- https://www.amazon.com/uxcell-Electric-Lifting-Electromagnet-Solenoid/dp/B01N3387AA/ref=sr_1_4?ie=UTF8&qid=1513817515&sr=8-4&keywords=electromagnet&th=1
- An electromagnet is connected to this header. 
  The electromagnet deactivates, dropping a 
  conterweight.
- A normally open limit switch connected to this 
  header is pressed by the mass as it raises
- IMA 0.5 PULLEY ACTION
- "Use a Pulley system that has an ideal 
  mechanical advantage (IMA) of 0.50 that lifts 
  an object that is at least 500 g at least 10 
  vertical cm before the object initiates the next 
  action."

## Sheet 15 of 16: End Task
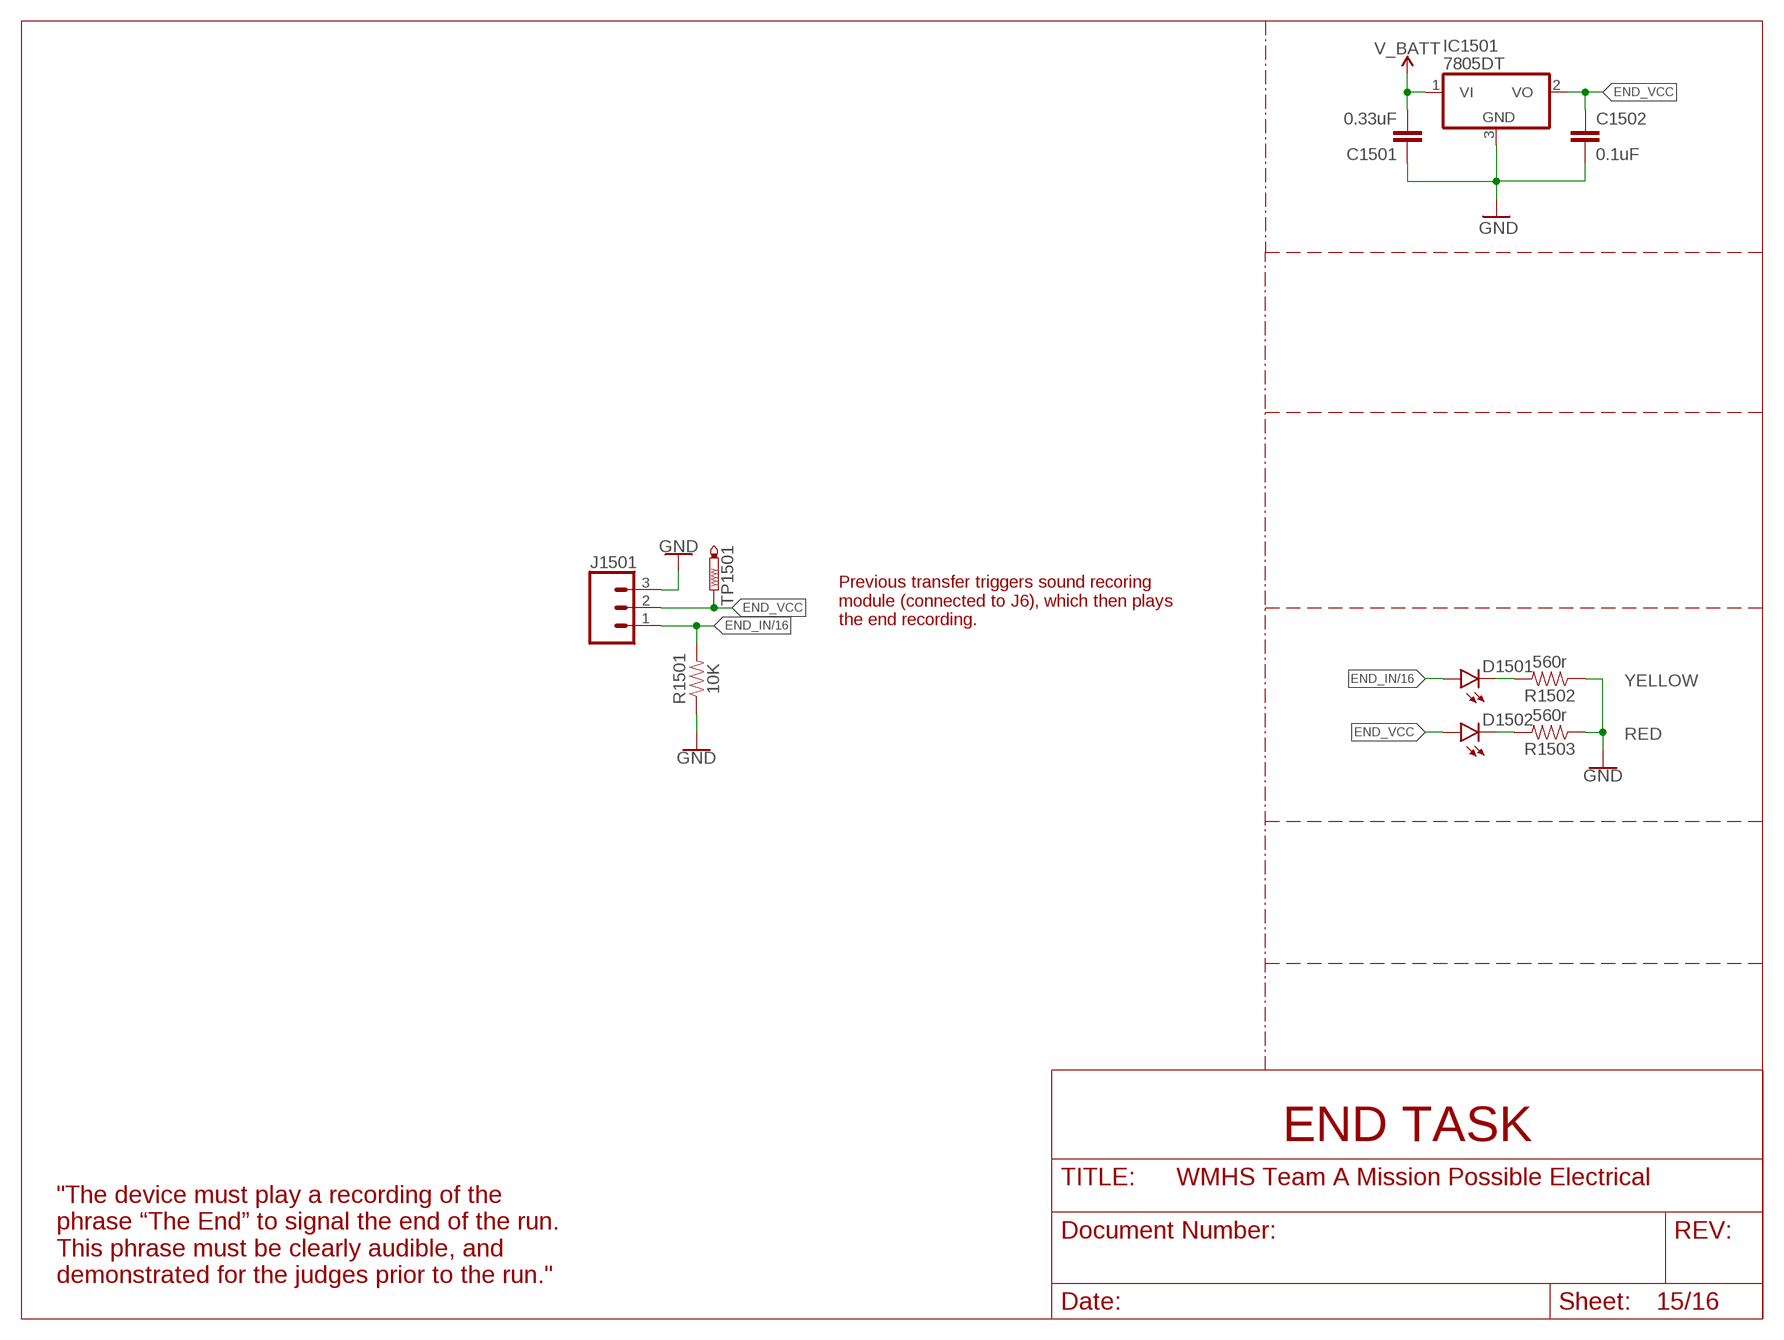
[diagram p14: schematic, sheet 15]

### Parts
C1501  0.33uF  0.1UF-0603-25V-(+80/-20%)  [0603]
C1502  0.1uF  0.1UF-0603-25V-(+80/-20%)  [0603]
D1501  YELLOW  LED-YELLOW0603  [LED-0603]
D1502  RED  LED-RED0603  [LED-0603]
IC1501  7805DT  [TO252]
J1501  CONN_03LOCK  [1X03_LOCK]
R1501  10K  RESISTOR0603  [0603]
R1502  560r  330OHM-0603-1/10W-1%  [0603]
R1503  560r  330OHM-0603-1/10W-1%  [0603]
TP1501  PTR1TP20R  [TP20R]

### Nets
END_IN: D1501.A J1501.1 R1501.2 ; also sheet 16
END_VCC: C1502.1 D1502.A IC1501.2(VO) J1501.2 TP1501.TP
GND: C1501.1 C1502.2 IC1501.3(GND) J1501.3 R1501.1 R1502.1 R1503.1 ; also sheet 1,2,3,4,5,6,7,8,9,10,11,12,13,14,16
N$129: D1502.C R1503.2
N$130: D1501.C R1502.2
V_BATT: C1501.2 IC1501.1(VI) ; also sheet 1,2,3,4,5,6,7,8,9,10,11,12,13,14,16

### Notes on the sheet
- Previous transfer triggers sound recoring 
  module (connected to J6), which then plays 
  the end recording.
- END TASK
- "The device must play a recording of the 
  phrase “The End” to signal the end of the run. 
  This phrase must be clearly audible, and 
  demonstrated for the judges prior to the run."

## Sheet 16 of 16: Non-action Components
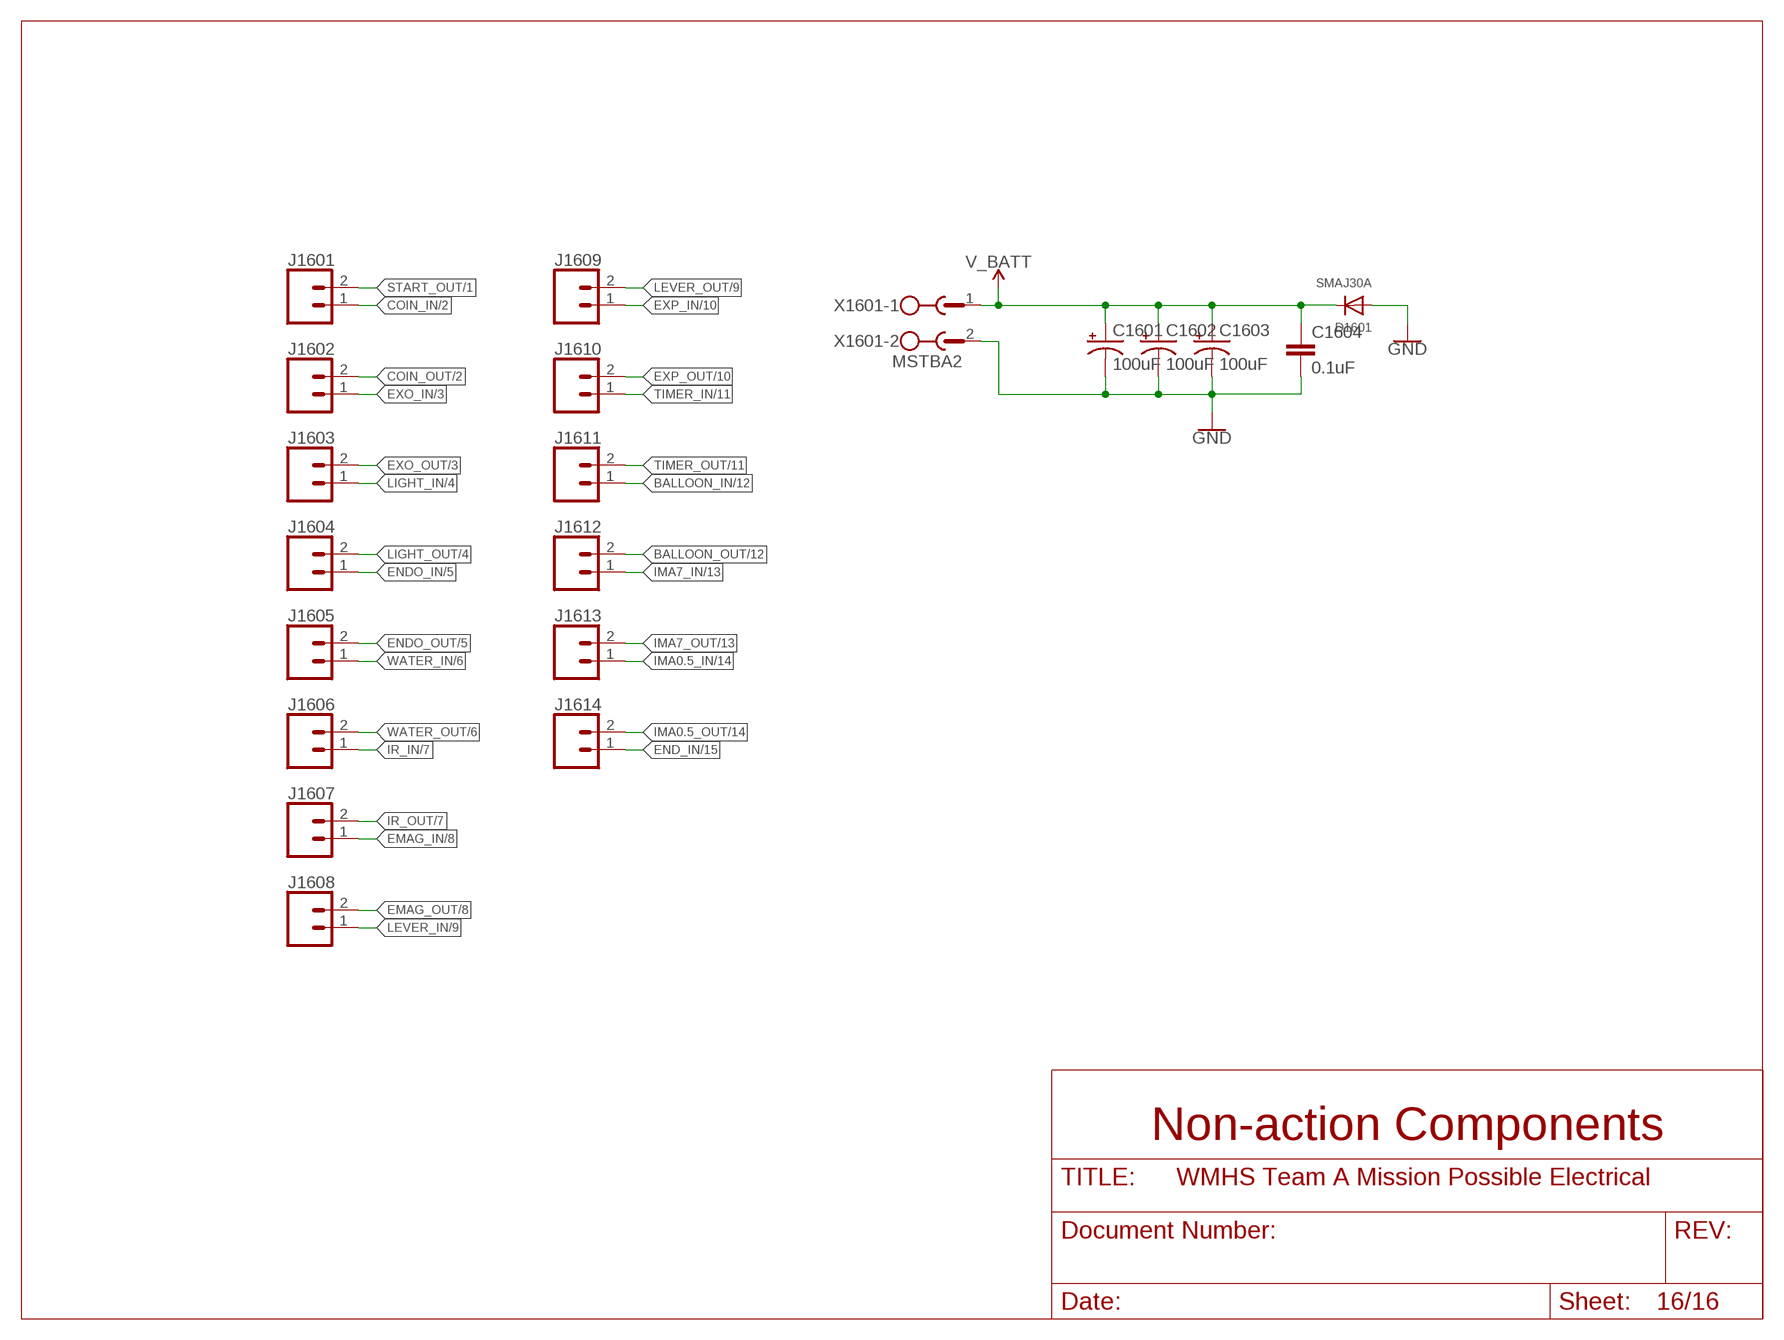
[diagram p15: schematic, sheet 16]

### Parts
C1601  100uF  100UF-POLAR-25V-20%(ELEC)  [PANASONIC_D]
C1602  100uF  100UF-POLAR-25V-20%(ELEC)  [PANASONIC_D]
C1603  100uF  100UF-POLAR-25V-20%(ELEC)  [PANASONIC_D]
C1604  0.1uF  0.1UF-0603-25V-5%  [0603]
D1601  SMAJ30A  DIODESMA  [SMADIODE]
J1601  CONN_02  [1X02]
J1602  CONN_02  [1X02]
J1603  CONN_02  [1X02]
J1604  CONN_02  [1X02]
J1605  CONN_02  [1X02]
J1606  CONN_02  [1X02]
J1607  CONN_02  [1X02]
J1608  CONN_02  [1X02]
J1609  CONN_02  [1X02]
J1610  CONN_02  [1X02]
J1611  CONN_02  [1X02]
J1612  CONN_02  [1X02]
J1613  CONN_02  [1X02]
J1614  CONN_02  [1X02]
X1601  MSTBA2  [MSTBA2]

### Nets
BALLOON_IN: J1611.1 ; also sheet 12
BALLOON_OUT: J1612.2 ; also sheet 12
COIN_IN: J1601.1 ; also sheet 2
COIN_OUT: J1602.2 ; also sheet 2
EMAG_IN: J1607.1 ; also sheet 8
EMAG_OUT: J1608.2 ; also sheet 8
END_IN: J1614.1 ; also sheet 15
ENDO_IN: J1604.1 ; also sheet 5
ENDO_OUT: J1605.2 ; also sheet 5
EXO_IN: J1602.1 ; also sheet 3
EXO_OUT: J1603.2 ; also sheet 3
EXP_IN: J1609.1 ; also sheet 10
EXP_OUT: J1610.2 ; also sheet 10
GND: C1601.- C1602.- C1603.- C1604.2 D1601.A X1601.2 ; also sheet 1,2,3,4,5,6,7,8,9,10,11,12,13,14,15
IMA0.5_IN: J1613.1 ; also sheet 14
IMA0.5_OUT: J1614.2 ; also sheet 14
IMA7_IN: J1612.1 ; also sheet 13
IMA7_OUT: J1613.2 ; also sheet 13
IR_IN: J1606.1 ; also sheet 7
IR_OUT: J1607.2 ; also sheet 7
LEVER_IN: J1608.1 ; also sheet 9
LEVER_OUT: J1609.2 ; also sheet 9
LIGHT_IN: J1603.1 ; also sheet 4
LIGHT_OUT: J1604.2 ; also sheet 4
START_OUT: J1601.2 ; also sheet 1
TIMER_IN: J1610.1 ; also sheet 11
TIMER_OUT: J1611.2 ; also sheet 11
V_BATT: C1601.+ C1602.+ C1603.+ C1604.1 D1601.C X1601.1 ; also sheet 1,2,3,4,5,6,7,8,9,10,11,12,13,14,15
WATER_IN: J1605.1 ; also sheet 6
WATER_OUT: J1606.2 ; also sheet 6

### Notes on the sheet
- Non-action Components

## Library data of the parts
C101 C202 C302 C402 C502 C602 C703 C801 C902 C1002 C1401 = SparkFun-Capacitors:10UF-POLAR: 10.0µF polarized capacitors A capacitor is a passive two-terminal electrical component used to store electrical energy temporarily in an electric field.; PROD_ID: CAP-00811; VALUE: 10uF
C201 C301 C401 C501 C601 C701 C702 C901 C1001 C1101 C1201 C1301 C1604 = SparkFun-Capacitors:0.1UF: 0.1µF ceramic capacitors A capacitor is a passive two-terminal electrical component used to store electrical energy temporarily in an electric field.; PROD_ID: CAP-08604
C1102 C1202 C1302 C1501 = SparkFun-Capacitors:0.1UF: 0.1µF ceramic capacitors A capacitor is a passive two-terminal electrical component used to store electrical energy temporarily in an electric field.; PROD_ID: CAP-00810; VALUE: 0.1uF
C1103 = SparkFun-Capacitors:0.1UF: 0.1µF ceramic capacitors A capacitor is a passive two-terminal electrical component used to store electrical energy temporarily in an electric field.; PROD_ID: CAP-08390
C1203 C1303 C1502 = SparkFun-Capacitors:0.1UF: 0.1µF ceramic capacitors A capacitor is a passive two-terminal electrical component used to store electrical energy temporarily in an electric field.; PROD_ID: CAP-00810
C1601-C1603 = SparkFun-Capacitors:100UF-POLAR: 100µF polarized capacitors A capacitor is a passive two-terminal electrical component used to store electrical energy temporarily in an electric field.; PROD_ID: CAP-12547
D101 D202 D302 D402 D502 D602 D701 D802 D902 D1002 D1101 D1201 D1301 D1402 = SparkFun-LED:LED-GREEN: Green SMD LED Used in manufacturing of various products at SparkFun Packages: 0603 - SMD 0603 package [Product Link] <http://www.futureelectronics.com/en/technologies/semiconductors/optoelectronics/leds/Pages/9894312-LTST-C190GKT.aspx?CrossPart=HSMG-C190&IM=0> LilyPad 1206 - SMD1206 LilyPad package [Product Link] <http://www.futureelectronics.com/en/Technologies/Product.aspx?ProductID=IN150NGHARVATEKCORPORATION2049943&IM=0> 1206 - SMD1206 package [Product Link] <http://www.futureelectronics.com/en/technologies/semiconductors/optoelectronics/leds/Pages/8315665-LTST-C150KGKT.aspx?IM=0> 1206 Bottom Mount -SMD 1206 Bottom Mount [Product Link] <http://www.digikey.com/product-detail/en/lite-on-inc/LTST-C230KGKT/160-1456-1-ND/386854> SparkFun Products: Pro Mini 328 -5V <https://www.sparkfun.com/products/821> RedBoard <https://www.sparkfun.com/products/12757> MP3 Trigger <https://www.sparkfun.com/products/13720> Makey Makey <https://www.sparkfun.com/products/11076>; PROD_ID: DIO-00821
D102 D204 D304 D404 D504 D604 D703 D804 D904 D1004 D1103 D1203 D1303 D1404 D1502 = SparkFun-LED:LED-RED: Red SMD LED Used in manufacturing of most products at SparkFun Packages: 0603 - SMD 0603 package [Product Link] <http://docs.avagotech.com/docs/AV02-0551EN> 0603 SMART - SMD 0603 SMART package ( more efficient and expensive)[Product Link] <http://www.osram-os.com/Graphics/XPic2/00077099_0.pdf> 1206 - SMD1206 package [Product Link] <https://www.sparkfun.com/datasheets/DevTools/LilyPad/Q150OVS4.pdff> SparkFun Products: Pro Mini 328 -5V <https://www.sparkfun.com/products/821> RedBoard <https://www.sparkfun.com/products/12757> IOIO-OTG <https://www.sparkfun.com/products/13613>; PROD_ID: DIO-00819
D201 D501 D601 D801 D901 D1001 D1401 D1601 = adafruit:DIODE: Diode SMADIODE - SMA Surface Mount Package 20V 1A Schottky Diode Digikey: 641-1014-6-ND DO-1N4148 - Through Hole Small Current Diode SOD-123 20V 1 A (.5mV Vf) Schottky Diode - Digikey: MBRX120TPMSCT-ND SOD-323 10V 570mA (.38mV Vf, 3ns) Schottky Diode - Digikey: ZLLS410CT-ND SOD-523 30V 30mA Schottky Diode (RB751S-40TE61) - Digikey: RB751S-40TE61CT-ND SOT23-R/W - SOT23 Package (R = Solder Paste/Reflow Ovens, W = Hand-Soldering) BAT54Film 40V 300mA - Digikey: 497-7162-1-ND
D203 D303 D403 D503 D603 D702 D803 D903 D1003 D1102 D1202 D1302 D1403 D1501 = SparkFun-LED:LED-YELLOW: Yellow SMD LED Used in manufacturing several products at SparkFun. Packages: 0603 - SMD 0603 package[Product Link] <http://www.kingbrightusa.com/product.asp?catalog_name=LED&product_id=APT1608SYCK> 0603 -SMART - SMART SMD 0603 package (more efficient/more expensive) [Product Link] <http://www.osram-os.com/osram_os/en/products/product-catalog/led-light-emitting-diodes/smartled-0603/ly-l29k/index.jsp> LilyPad - SMD1206 package[Product Datasheet] <https://www.sparkfun.com/datasheets/DevTools/LilyPad/Q150YUS4.pdf> SparkFun Products: Blynk Board <https://www.sparkfun.com/products/13794> IOIO-OTG <https://www.sparkfun.com/products/13613> XBee Explorer Serial <https://www.sparkfun.com/products/13225>; PROD_ID: DIO-09003; VALUE: Yellow
D301 D401 = SparkFun-LED:LED: LED (Generic) Standard schematic elements and footprints for 5mm, 3mm, 1206, and 0603 sized LEDs. Generic LEDs with no color specified.; PROD_ID: DIO-08794
IC1101 IC1201 IC1301 IC1501 = linear:78*: Positive VOLTAGE REGULATOR Source: http://cache.national.com/ds/LM/LM78L05.pdf http://www.fairchildsemi.com/ds/LM/LM7805.pdf
J201 J701 J1501 = SparkFun-Connectors:CONN_03: Multi connection point. Often used as Generic Header-pin footprint for 0.1 inch spaced/style header connections On any of the 0.1 inch spaced packages, you can populate with these: Break Away Headers - Straight <https://www.sparkfun.com/products/116> (PRT-00116) Break Away Male Headers - Right Angle <https://www.sparkfun.com/products/553> (PRT-00553) Female Headers <https://www.sparkfun.com/products/115> (PRT-00115) Break Away Headers - Machine Pin <https://www.sparkfun.com/products/117> (PRT-00117) Break Away Female Headers - Swiss Machine Pin <https://www.sparkfun.com/products/743> (PRT-00743) Stackable Header - 3 Pin (Female, 0.1") <https://www.sparkfun.com/products/13875> (PRT-13875) For SCREWTERMINALS and SPRING TERMINALS visit here: Screw Terimnals on SparkFun.com <https://www.sparkfun.com/search/results?term=Screw+Terminals> (5mm/3.5mm/2.54mm spacing) This device is also useful as a general connection point to wire up your design to another part of your project. Our various solder wires solder well into these plated through hole pads. Hook-Up Wire - Assortment (Stranded, 22 AWG) <https://www.sparkfun.com/products/11375> (PRT-11375) Hook-Up Wire - Assortment (Solid Core, 22 AWG) <https://www.sparkfun.com/products/11367> (PRT-11367) View the entire wire category on our website here <https://www.sparkfun.com/categories/141> Special notes: Molex polarized connector foot print use with SKU : PRT-08232 with associated crimp pins and housings.
J202 J501 J601 J702 J801 J901 J1002-J1004 J1101-J1103 J1201-J1203 J1301-J1303 J1401 J1601-J1614 = SparkFun-Connectors:CONN_02: Multi connection point. Often used as Generic Header-pin footprint for 0.1 inch spaced/style header connections On any of the 0.1 inch spaced packages, you can populate with these: Break Away Headers - Straight <https://www.sparkfun.com/products/116> (PRT-00116) Break Away Male Headers - Right Angle <https://www.sparkfun.com/products/553> (PRT-00553) Female Headers <https://www.sparkfun.com/products/115> (PRT-00115) Break Away Headers - Machine Pin <https://www.sparkfun.com/products/117> (PRT-00117) Break Away Female Headers - Swiss Machine Pin <https://www.sparkfun.com/products/743> (PRT-00743) For SCREWTERMINALS and SPRING TERMINALS visit here: Screw Terimnals on SparkFun.com <https://www.sparkfun.com/search/results?term=Screw+Terminals> (5mm/3.5mm/2.54mm spacing) This device is also useful as a general connection point to wire up your design to another part of your project. Our various solder wires solder well into these plated through hole pads. Hook-Up Wire - Assortment (Stranded, 22 AWG) <https://www.sparkfun.com/products/11375> (PRT-11375) Hook-Up Wire - Assortment (Solid Core, 22 AWG) <https://www.sparkfun.com/products/11367> (PRT-11367) View the entire wire category on our website here <https://www.sparkfun.com/categories/141> Special notes: Molex polarized connector foot print use with: PRT-08233 with associated crimp pins and housings. 2.54_SCREWTERM for use with PRT-10571. 3.5mm Screw Terminal footprints for PRT-08084 5mm Screw Terminal footprints for use with PRT-08432
J203 J502 J602 J802 J902 J1001 J1402 = SparkFun-Connectors:CONN_02: Multi connection point. Often used as Generic Header-pin footprint for 0.1 inch spaced/style header connections On any of the 0.1 inch spaced packages, you can populate with these: Break Away Headers - Straight <https://www.sparkfun.com/products/116> (PRT-00116) Break Away Male Headers - Right Angle <https://www.sparkfun.com/products/553> (PRT-00553) Female Headers <https://www.sparkfun.com/products/115> (PRT-00115) Break Away Headers - Machine Pin <https://www.sparkfun.com/products/117> (PRT-00117) Break Away Female Headers - Swiss Machine Pin <https://www.sparkfun.com/products/743> (PRT-00743) For SCREWTERMINALS and SPRING TERMINALS visit here: Screw Terimnals on SparkFun.com <https://www.sparkfun.com/search/results?term=Screw+Terminals> (5mm/3.5mm/2.54mm spacing) This device is also useful as a general connection point to wire up your design to another part of your project. Our various solder wires solder well into these plated through hole pads. Hook-Up Wire - Assortment (Stranded, 22 AWG) <https://www.sparkfun.com/products/11375> (PRT-11375) Hook-Up Wire - Assortment (Solid Core, 22 AWG) <https://www.sparkfun.com/products/11367> (PRT-11367) View the entire wire category on our website here <https://www.sparkfun.com/categories/141> Special notes: Molex polarized connector foot print use with: PRT-08233 with associated crimp pins and housings. 2.54_SCREWTERM for use with PRT-10571. 3.5mm Screw Terminal footprints for PRT-08084 5mm Screw Terminal footprints for use with PRT-08432; PROD_ID: CONN-08399
J204 J301 J401 J503 J603 J703 J704 J903 J1005 J1104 J1204 J1304 = SparkFun-Connectors:AVR_SPI_PROG_3X2: AVR ISP 6 Pin This is the reduced ISP connector for AVR programming. Common on Arduino. This footprint will take up less PCB space and can be used with a 10-pin to 6-pin adapter such as SKU: BOB-08508 **Special note about "TEST_POINT" package. The stop mask is on the top side, so if you want your programming test points to be on the bottom of your board, make sure to place this package on the bottom side of the board. This also ensure that the orientation to program from the bottom side will be correct. SparkFun Products: SparkFun ISP Pogo Adapter <https://www.sparkfun.com/products/11591> - NS Tiny AVR Programmer <https://www.sparkfun.com/products/11801> -PTH
JP101 JP202 JP1402 = SparkFun-Jumpers:JUMPER-SMT_2_NC_TRACE: Normally closed trace jumper This jumper has a trace between two pads so it's normally closed (NC). Use a razor knife to open the connection. For best results follow the IPC guidelines for cutting traces: Cutout at least 0.063 mm (0.005 in). Remove all loose material to clean up the cut area. Seal the cut with an approved epoxy. Reapply solder to reclose the connection.
JP102 JP201 JP1401 = SparkFun-Jumpers:JUMPER-SMT_2_NO: Normally open jumper This jumper has two pads in close proximity to each other. Apply solder to close the connection. Round pads are easier to solder for beginners, but are a lot larger. SparkFun Product that uses the round pads: SparkFun EL Sequencer <https://www.sparkfun.com/products/12781>
Q201 Q501 Q601 Q801 Q901 Q1001 Q1401 = Mission Possible Special Parts:PSMN7R0-60YS
Q301 Q401 = SparkFun-DiscreteSemi:TRANS_NPN: NPN transistor Current controlled devices typically used to amplify current or used as a switch. BC547 - COM-08928 <http://www.sparkfun.com/products/8928> (TO-92 45V 100mA) (1.Collector 2.Base 3.Emitter) 2N3904 - COM-00521 <http://www.sparkfun.com/products/521> (TO-92 40V 200mA) (1.Emitter 2.Base 3.Collector) P2N2222A - COM-12852 <http://www.sparkfun.com/products/12852> (TO-92 40V 600mA) (1.Collector 2.Base 3.Emitter); PROD_ID: TRANS-09116
R101-R103 R204-R207 R304-R307 R405-R408 R504-R507 R604-R607 R703-R707 R804-R806 R904-R907 R1005-R1008 R1103-R1106 R1203-R1206 R1303-R1306 R1404-R1406 R1502 R1503 = SparkFun-Resistors:330OHM: 330Ω resistor A resistor is a passive two-terminal electrical component that implements electrical resistance as a circuit element. Resistors act to reduce current flow, and, at the same time, act to lower voltage levels within circuits. - Wikipedia; PROD_ID: RES-00818; VALUE: 330
R201-R203 R301 R302 R401 R403 R404 R501-R503 R601-R603 R701 R702 R801-R803 R901-R903 R1001-R1004 R1101 R1102 R1201 R1202 R1301 R1302 R1401-R1403 R1501 = SparkFun-Resistors:RESISTOR: Generic Resistor Package
R303 R402 = SparkFun-Sensors:PHOTOCELL: Photocell (Photodetector, Photo Resistor, CdS) This is a very small light sensor. A photocell changes (also called a photodetector, photo resistor, CdS or photoconductive cell) resistance depending on the amount of light it is exposed to. These little sensors make great ambient light triggers (when light in the room turns on, do something). Datasheet <http://cdn.sparkfun.com/datasheets/Sensors/LightImaging/SEN-09088.pdf> SparkFun Products Mini Photocell <https://www.sparkfun.com/products/9088> (SEN-09088); PROD_ID: COMP-09129; SF_ID: SEN-09088
S101 = Mission Possible Special Parts:MDSM-10_REED_SWITCH
S102 S202 S302 S402 S502 S602 S703 S801 S902 S1002 S1102 S1202 S1302 S1401 = SparkFun-Switches:SWITCH-SPDT: Single Pole, Double Throw (SPDT) Switch Single-pole, double-throw (SPDT) switch. Variant Overview SMD-AYZ0202 Surface Mount DPDT Switch <https://www.sparkfun.com/products/597> (COM-00597) Used on e.g. LilyPad Arduino USB - ATmega32U4 Board <https://www.sparkfun.com/products/12049> PTH-11.6X4.0MM SPDT Mini Power Switch <https://www.sparkfun.com/products/102> (COM-00102) Used on e.g. SparkFun Simon Says - Through-Hole Soldering Kit <https://www.sparkfun.com/products/10547> (KIT-10547) PTH-11.6X4.0MM-KIT KIT version of SPDT Mini Power Switch - Simplifies soldering by removing tStop of switch pins - only one side can be soldered. PTH-11.6X4.0MM-LOCK LOCK version of SPDT Mini Power Switch - Offset pins hold switch in place for easier soldering. SMD-RIGHT-ANGLE Surface Mount Right Angle Switch <https://www.sparkfun.com/products/10860> (COM-10860) Used on e.g. SparkFun ESP8266 Thing <https://www.sparkfun.com/products/13231>; PROD_ID: SWCH-08179; SF_ID: COM-00597
S201 S301 S401 S501 S601 S701 S702 S901 S1001 S1101 S1201 S1301 = SparkFun-Switches:MOMENTARY-SWITCH-SPST: Momentary Switch (Pushbutton) - SPST Normally-open (NO) SPST momentary switches (buttons, pushbuttons). Variants PTH-12MM - 12mm square, through-hole Momentary Pushbutton Switch - 12mm Square <https://www.sparkfun.com/products/9190> (COM-09190) PTH-6.0MM, PTH-6.0MM-KIT - 6.0mm square, through-hole Mini Pushbutton Switch <https://www.sparkfun.com/products/97> (COM-00097) KIT package intended for soldering kit's - only one side of pads' copper is exposed. PTH-RIGHT-ANGLE-KIT - Right-angle, through-hole Right Angle Tactile Button <https://www.sparkfun.com/products/10791> - Used on SparkFun BigTime Watch Kit <https://www.sparkfun.com/products/11734> SMD-12MM - 12mm square, surface-mount Tactile Button - SMD (12mm) <https://www.sparkfun.com/products/12993> (COM-12993) Used on SparkFun PicoBoard <https://www.sparkfun.com/products/11888> SMD-4.5MM - 4.5mm Square Trackball Switch Used on SparkFun Blackberry Trackballer Breakout <https://www.sparkfun.com/products/13169> SMD-4.6MMX2.8MM - 4.60mm x 2.80mm, surface mount Used on SparkFun SAMD21 Mini Breakout <https://www.sparkfun.com/products/13664> SMD-5.2MM, SMD-5.2-REDUNDANT - 5.2mm square, surface-mount Mini Pushbutton Switch - SMD <https://www.sparkfun.com/products/8720> (COM-08720) Used on Arduino Pro Mini <https://www.sparkfun.com/products/11114> REDUNDANT package connects both switch circuits together SMD-6.0X3.5MM - 6.0 x 3.5mm, surface mount Momentary Reset Switch SMD <https://www.sparkfun.com/products/8229> (COM-08229) SMD-6.2MM-TALL - 6.2mm square, surface mount Tactile Button - SMD (6mm) <https://www.sparkfun.com/products/12992> Used on SparkFun Digital Sandbox <https://www.sparkfun.com/products/12651> SMD-RIGHT-ANGLE - Right-angle, surface mount Used on SparkFun Block for Intel® Edison - Arduino <https://www.sparkfun.com/products/13036>; PROD_ID: SWCH-08247; SF_SKU: COM-08720
TP101 TP201-TP203 TP301-TP303 TP401-TP404 TP501-TP504 TP601-TP604 TP701-TP703 TP801-TP803 TP901 TP902 TP1001 TP1002 TP1101 TP1102 TP1201 TP1202 TP1301 TP1302 TP1401 TP1402 TP1501 = testpad:PTR1: TEST PIN
U101 U201 U301 U401 U501 U601 U801 U1401 = SparkFun-IC-Logic:74*1G04: Single Inverter IC NOT GATE INVERTER SNGL 1IN SOT353 Supply: 1.65V to 5.5V Datasheet <http://diodes.com/datasheets/74LVC1G04.pdf> SparkFun Products SparkFun Stepoko <https://www.sparkfun.com/products/13899> (ROB-13899) SparkFun CryptoShield <https://www.sparkfun.com/products/13183> (DEV-13183) SparkFun LogicBlocks Kit <https://www.sparkfun.com/products/11006> (KIT-11006) SparkFun ArduMoto <https://www.sparkfun.com/products/9815> (DEV-09815); PROD_ID: COMP-08268
U102 U203 U304 U404 U504 U604 U703 U803 U902 U1002 U1402 = SparkFun-IC-Power:V_REG_MIC5205: V_REG MIC5205 Standard 3.3V, 5V, and Adjustable 150mA LDO voltage regulator in SOT-23 layout. Micrel part MIC5205. BP (by-pass) pin is used to lower output noise with 470pF cap, may be left open. On the adjustable version BP is used to set output.; PROD_ID: VREG-00823; VALUE: 5V
U202 U303 U403 U503 U603 U701 U702 U901 U1001 U1102 U1202 U1302 = SparkFun-Retired:ATTINY45: Atmel 8-pin 2/4/8kB flash uC Retired
U302 U402 U502 U602 U802 = m-pad-2.1:SN74**C1G08: Ti's SN74AHC1G08 is a single 2-input positive-AND gate Description: The SN74AHC1G08 is a single 2-input positive-AND gate. The device performs the Boolean function Y = A * B in positive logic. Features: Operating Range of 2 V to 5.5 V Max tpd of 7 ns at 5 V Low Power Consumption, 10-uA Max ICC ±8-mA Output Drive at 5 V Schmitt-Trigger Action at All Inputs Makes the Circuit Tolerant for Slower Input Rise and Fall Time Latch-Up Performance Exceeds 250 mA Per JESD 17 ESD Protection Exceeds JESD 22 - 2000-V Human-Body Model (A114-A) - 200-V Machine Model (A115-A) - 1000-V Charged-Device Model (C101) Please send any comments to: messi@users.sourceforge.net
U1101 U1201 U1301 = SparkFun-IC-Special-Function:DRV883X: DRV8835 2 Channel Motor Driver Dual 1.5A H-bridge, 2-11V Datasheet <http://www.ti.com/lit/ds/symlink/drv8835.pdf> SparkFun Products: SparkFun Serial Controlled Motor Driver <https://www.sparkfun.com/products/13911>; PROD_ID: IC-13342
X1601 = con-phoenix-508:MSTBA2: PHOENIX; MF: FARNELL; MPN: 1757242; OC_FARNELL: 3705171; OC_NEWARK: 71C4161